# Altium project IMX8SoCIot.PrjPcb (part 3 of 9)

## Sheet IMX8_DISPLAY.SchDoc
size 594 x 420 mm; SheetNumber: 10; SheetTotal: 20
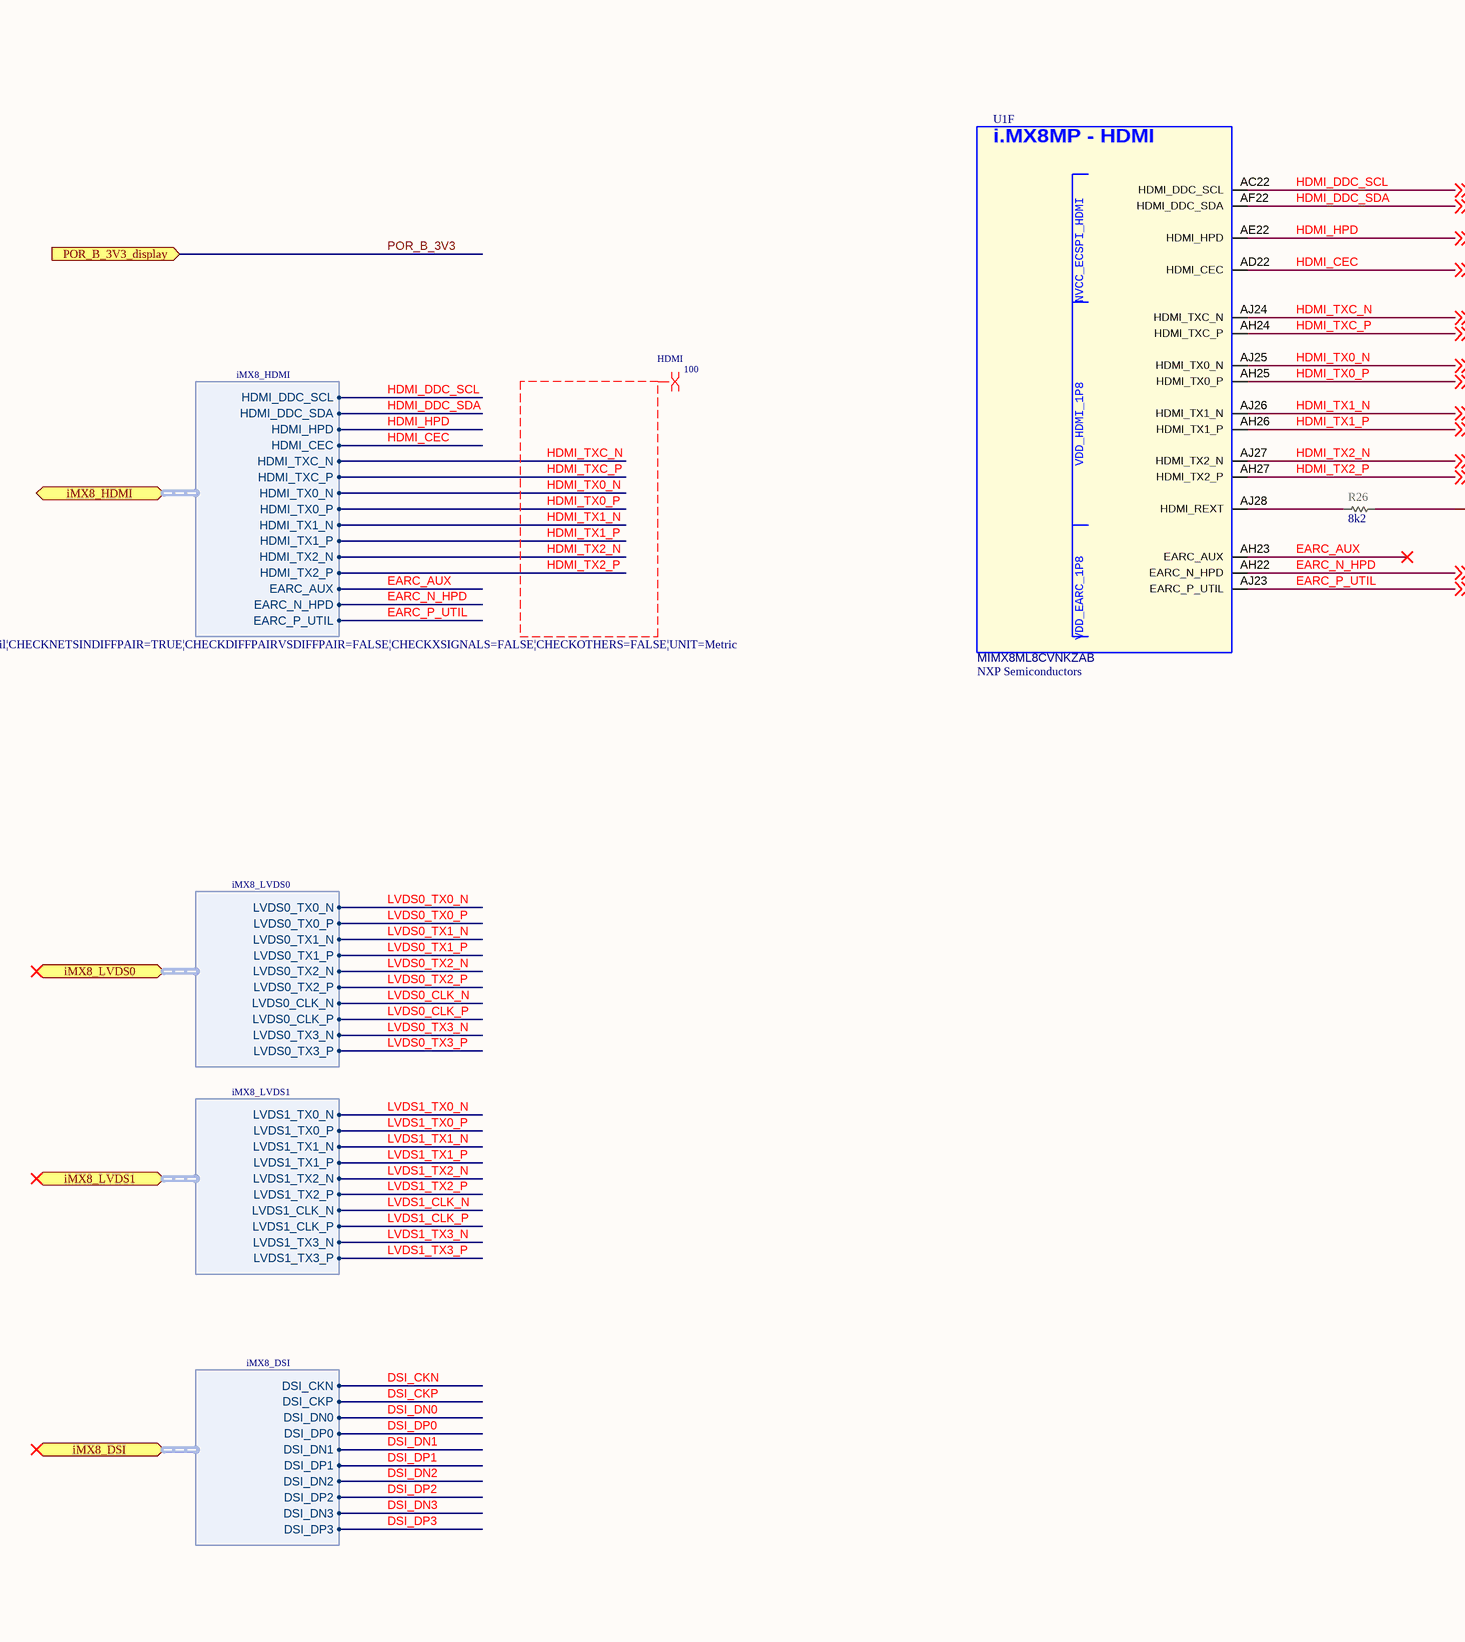
[diagram p8: IMX8_DISPLAY.SchDoc, left]
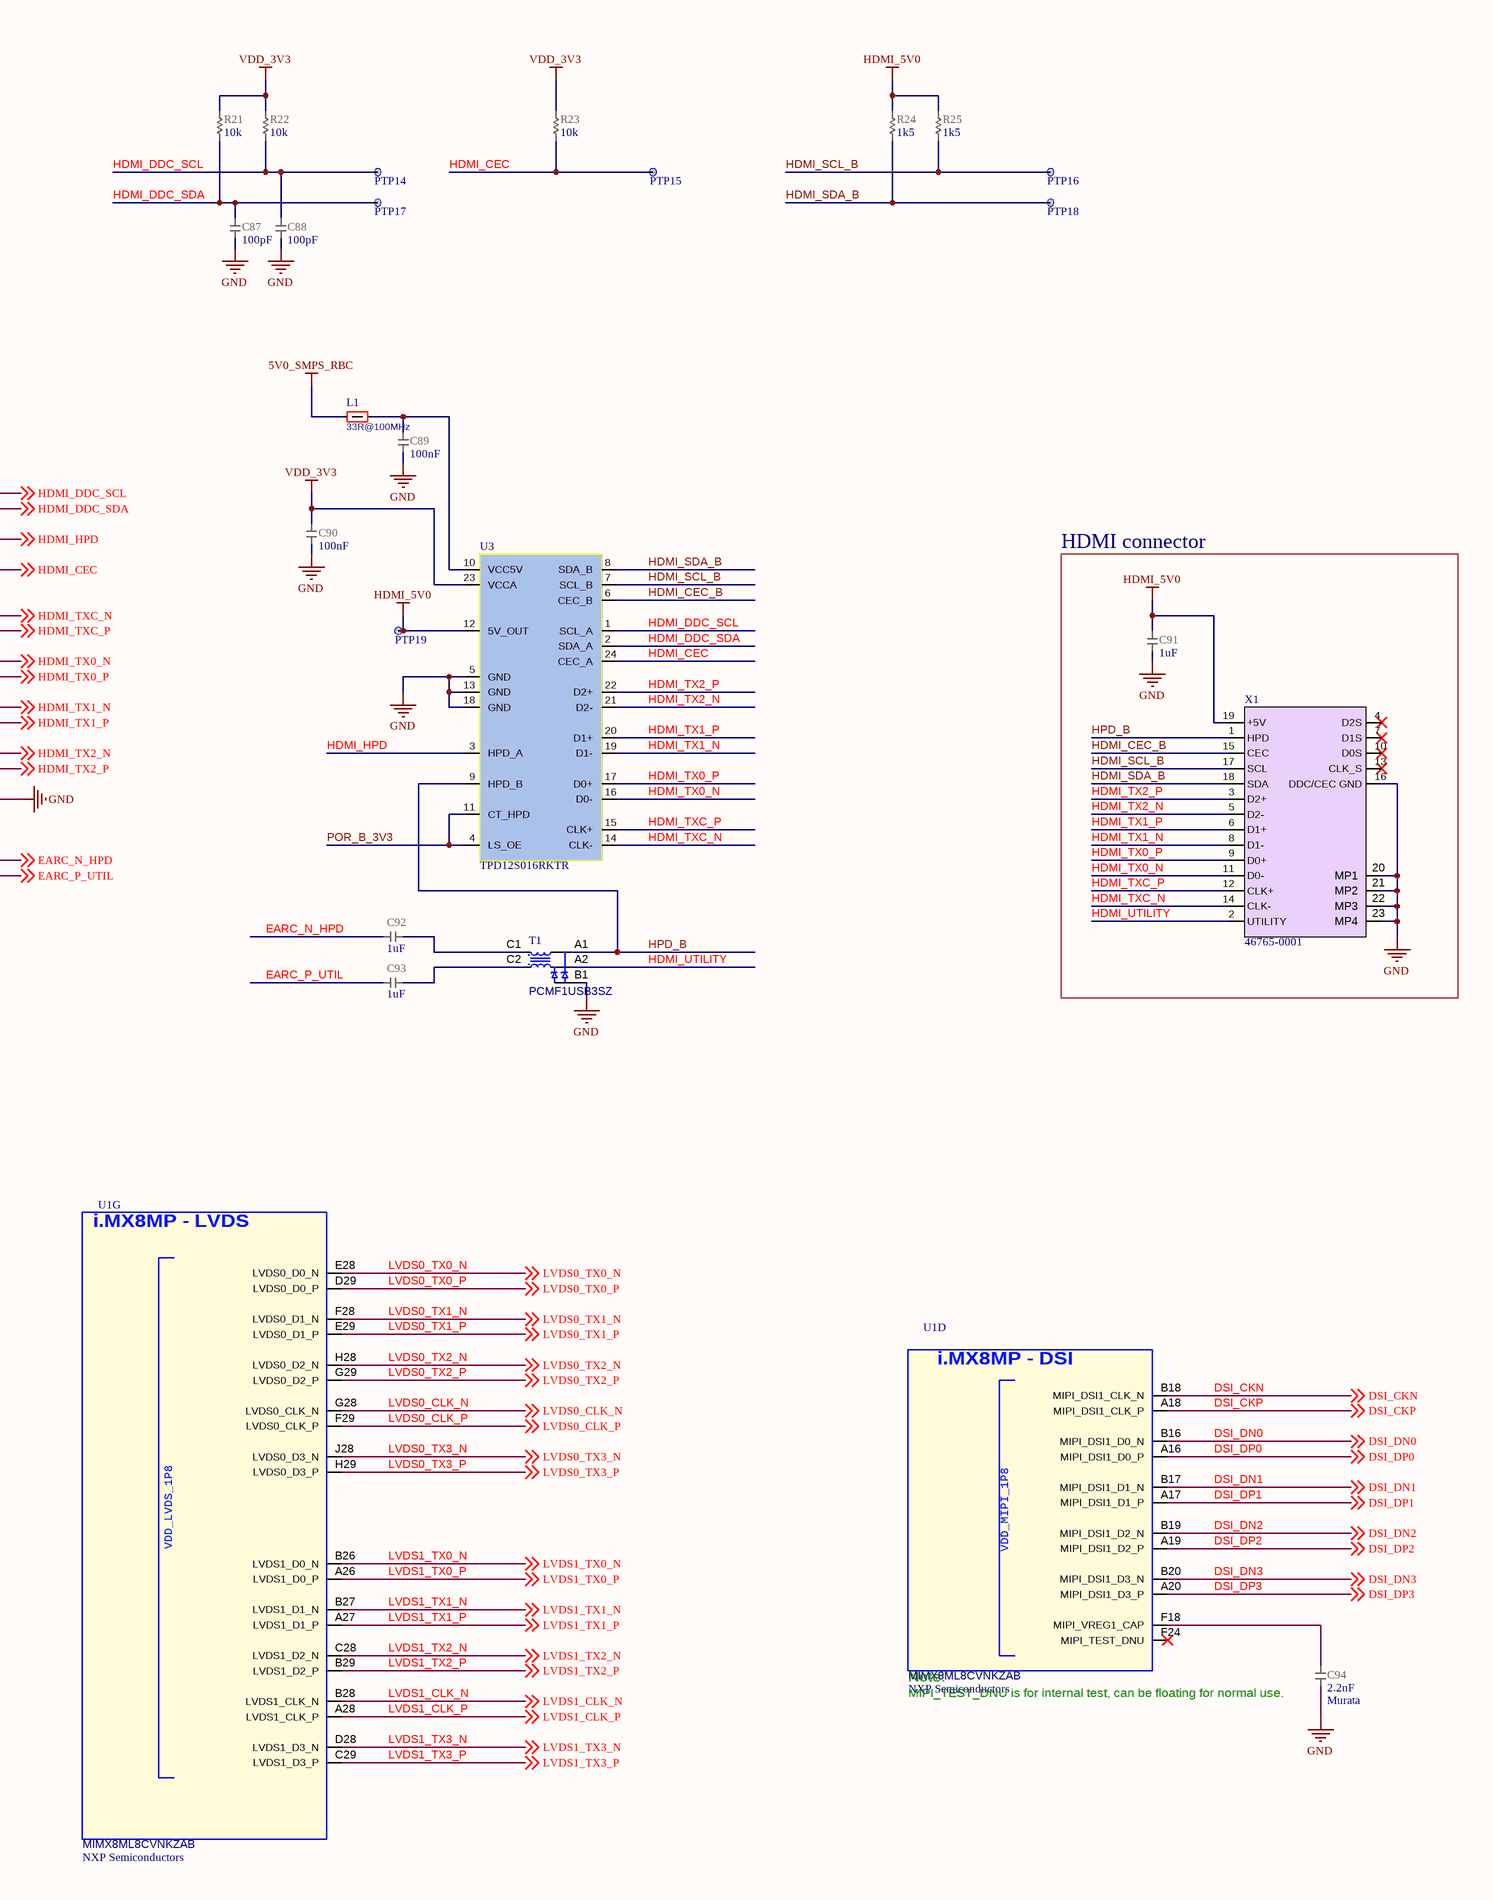
[diagram p9: IMX8_DISPLAY.SchDoc, right]

### Parts
C87  value 100pF  [CAP_0201_UN1Q]  (hidden comment: CAP_0201_100p)
C88  value 100pF  [CAP_0201_UN1Q]  (hidden comment: CAP_0201_100p)
C89  value 100nF  [CAP_0201_UN1Q]  (hidden comment: CAP_0201_100n_X7S_16V)
C90  value 100nF  [CAP_0201_UN1Q]  (hidden comment: CAP_0201_100n_X7S_16V)
C91  value 1uF  [CAP_0201_UN1Q]  (hidden comment: CAP_0201_1uF_X6S)
C92  value 1uF  [CAP_0201_UN1Q]  (hidden comment: CAP_0201_1uF_X6S)
C93  value 1uF  [CAP_0201_UN1Q]  (hidden comment: CAP_0201_1uF_X6S)
C94  value 2.2nF  Manufacturer: Murata  [CAP_0201_UN1Q]  (hidden comment: CAP_0201_2n2)
L1  value 33R@100MHz  [IND_0201_UN1Q]  (hidden comment: FERRITE_0201_BLM03_33Ohm)
PTP14  PTP_0.4mm  [PTP_0.4mm]  (value not drawn)  (no BOM)
PTP15  PTP_0.4mm  [PTP_0.4mm]  (value not drawn)  (no BOM)
PTP16  PTP_0.4mm  [PTP_0.4mm]  (value not drawn)  (no BOM)
PTP17  PTP_0.4mm  [PTP_0.4mm]  (value not drawn)  (no BOM)
PTP18  PTP_0.4mm  [PTP_0.4mm]  (value not drawn)  (no BOM)
PTP19  PTP_0.4mm  [PTP_0.4mm]  (value not drawn)  (no BOM)
R21  value 10k  [RES_0201_UN1Q]  (hidden comment: RES_0201_10k)
R22  value 10k  [RES_0201_UN1Q]  (hidden comment: RES_0201_10k)
R23  value 10k  [RES_0201_UN1Q]  (hidden comment: RES_0201_10k)
R24  value 1k5  [RES_0201_UN1Q]  (hidden comment: RES_0201_1k5)
R25  value 1k5  [RES_0201_UN1Q]  (hidden comment: RES_0201_1k5)
R26  value 8k2  [RES_0201_UN1Q]  (hidden comment: RES_0201_8k2)
T1  Part Number: PCMF1USB3SZ  [PCMF1USB3S_EMI]  (hidden comment: EMI_ESD_PCMF1USB3SZ)
U1  Manufacturer: NXP Semiconductors  [BGA548C50P29X29_1500X1500X148]  (hidden comment: MIMX8ML8CVNKZAB)  (parts D,F,G of 15)
U3  Part Number: TPD12S016RKTR  [UQFN24_RKT0024A_TI]  (hidden comment: TPD12S016RKT)
X1  Part Number: 46765-0001  [uHDMI-SMD-Molex]  (hidden comment: Molex_uHDMI_46765-0001)

### Blocks framed on the sheet
HDMI connector: C91 X1

### Ports
iMX8_DSI (bidir, harness iMX8_DSI), iMX8_HDMI (bidir, harness iMX8_HDMI), iMX8_LVDS0 (bidir, harness iMX8_LVDS0), iMX8_LVDS1 (bidir, harness iMX8_LVDS1), POR_B_3V3_display (in)

### Harnesses
iMX8_LVDS0: LVDS0_TX0_N, LVDS0_TX0_P, LVDS0_TX1_N, LVDS0_TX1_P, LVDS0_TX2_N, LVDS0_TX2_P, LVDS0_CLK_N, LVDS0_CLK_P, LVDS0_TX3_N, LVDS0_TX3_P
iMX8_LVDS1: LVDS1_TX0_N, LVDS1_TX0_P, LVDS1_TX1_N, LVDS1_TX1_P, LVDS1_TX2_N, LVDS1_TX2_P, LVDS1_CLK_N, LVDS1_CLK_P, LVDS1_TX3_N, LVDS1_TX3_P
iMX8_DSI: DSI_CKN, DSI_CKP, DSI_DN0, DSI_DP0, DSI_DN1, DSI_DP1, DSI_DN2, DSI_DP2, DSI_DN3, DSI_DP3
iMX8_HDMI: HDMI_DDC_SCL, HDMI_DDC_SDA, HDMI_HPD, HDMI_CEC, EARC_AUX, EARC_N_HPD, EARC_P_UTIL, HDMI_TXC_N, HDMI_TXC_P, HDMI_TX0_N, HDMI_TX0_P, HDMI_TX1_N, HDMI_TX1_P, HDMI_TX2_N, HDMI_TX2_P

### Nets
5V0_SMPS_RBC: L1.1
GND: C87.1 C88.1 C89.2 C90.2 C91.1 C94.1 R26.2 T1.B1 U3.5(GND) U3.13(GND) U3.18(GND) X1.16(DDC/CEC_GND) X1.20(MP1) X1.21(MP2) X1.22(MP3) X1.23(MP4)
HDMI_5V0: C91.2 PTP19.1(TP) R24.2 R25.2 U3.12(5V_OUT) X1.19(+5V)
VDD_3V3: C90.1 R21.2 R22.2 R23.2 U3.23(VCCA)
DSI_CKN: U1.B18(MIPI_DSI1_CLK_N) ; off-sheet DSI_CKN, port iMX8_DSI.DSI_CKN
DSI_CKP: U1.A18(MIPI_DSI1_CLK_P) ; off-sheet DSI_CKP, port iMX8_DSI.DSI_CKP
DSI_DN0: U1.B16(MIPI_DSI1_D0_N) ; off-sheet DSI_DN0, port iMX8_DSI.DSI_DN0
DSI_DN1: U1.B17(MIPI_DSI1_D1_N) ; off-sheet DSI_DN1, port iMX8_DSI.DSI_DN1
DSI_DN2: U1.B19(MIPI_DSI1_D2_N) ; off-sheet DSI_DN2, port iMX8_DSI.DSI_DN2
DSI_DN3: U1.B20(MIPI_DSI1_D3_N) ; off-sheet DSI_DN3, port iMX8_DSI.DSI_DN3
DSI_DP0: U1.A16(MIPI_DSI1_D0_P) ; off-sheet DSI_DP0, port iMX8_DSI.DSI_DP0
DSI_DP1: U1.A17(MIPI_DSI1_D1_P) ; off-sheet DSI_DP1, port iMX8_DSI.DSI_DP1
DSI_DP2: U1.A19(MIPI_DSI1_D2_P) ; off-sheet DSI_DP2, port iMX8_DSI.DSI_DP2
DSI_DP3: U1.A20(MIPI_DSI1_D3_P) ; off-sheet DSI_DP3, port iMX8_DSI.DSI_DP3
EARC_AUX: U1.AH23(EARC_AUX) ; port iMX8_HDMI.EARC_AUX
EARC_N_HPD: C92.1 U1.AH22(EARC_N_HPD) ; off-sheet EARC_N_HPD, port iMX8_HDMI.EARC_N_HPD
EARC_P_UTIL: C93.1 U1.AJ23(EARC_P_UTIL) ; off-sheet EARC_P_UTIL, port iMX8_HDMI.EARC_P_UTIL
HDMI_CEC: PTP15.1(TP) R23.1 U1.AD22(HDMI_CEC) U3.24(CEC_A) ; off-sheet HDMI_CEC, port iMX8_HDMI.HDMI_CEC
HDMI_CEC_B: U3.6(CEC_B) X1.15(CEC)
HDMI_DDC_SCL: C88.2 PTP14.1(TP) R22.1 U1.AC22(HDMI_DDC_SCL) U3.1(SCL_A) ; off-sheet HDMI_DDC_SCL, port iMX8_HDMI.HDMI_DDC_SCL
HDMI_DDC_SDA: C87.2 PTP17.1(TP) R21.1 U1.AF22(HDMI_DDC_SDA) U3.2(SDA_A) ; off-sheet HDMI_DDC_SDA, port iMX8_HDMI.HDMI_DDC_SDA
HDMI_HPD: U1.AE22(HDMI_HPD) U3.3(HPD_A) ; off-sheet HDMI_HPD, port iMX8_HDMI.HDMI_HPD
HDMI_SCL_B: PTP16.1(TP) R25.1 U3.7(SCL_B) X1.17(SCL)
HDMI_SDA_B: PTP18.1(TP) R24.1 U3.8(SDA_B) X1.18(SDA)
HDMI_TX0_N: U1.AJ25(HDMI_TX0_N) U3.16(D0-) X1.11(D0-) ; off-sheet HDMI_TX0_N, port iMX8_HDMI.HDMI_TX0_N
HDMI_TX0_P: U1.AH25(HDMI_TX0_P) U3.17(D0+) X1.9(D0+) ; off-sheet HDMI_TX0_P, port iMX8_HDMI.HDMI_TX0_P
HDMI_TX1_N: U1.AJ26(HDMI_TX1_N) U3.19(D1-) X1.8(D1-) ; off-sheet HDMI_TX1_N, port iMX8_HDMI.HDMI_TX1_N
HDMI_TX1_P: U1.AH26(HDMI_TX1_P) U3.20(D1+) X1.6(D1+) ; off-sheet HDMI_TX1_P, port iMX8_HDMI.HDMI_TX1_P
HDMI_TX2_N: U1.AJ27(HDMI_TX2_N) U3.21(D2-) X1.5(D2-) ; off-sheet HDMI_TX2_N, port iMX8_HDMI.HDMI_TX2_N
HDMI_TX2_P: U1.AH27(HDMI_TX2_P) U3.22(D2+) X1.3(D2+) ; off-sheet HDMI_TX2_P, port iMX8_HDMI.HDMI_TX2_P
HDMI_TXC_N: U1.AJ24(HDMI_TXC_N) U3.14(CLK-) X1.14(CLK-) ; off-sheet HDMI_TXC_N, port iMX8_HDMI.HDMI_TXC_N
HDMI_TXC_P: U1.AH24(HDMI_TXC_P) U3.15(CLK+) X1.12(CLK+) ; off-sheet HDMI_TXC_P, port iMX8_HDMI.HDMI_TXC_P
HDMI_UTILITY: T1.A2 X1.2(UTILITY)
HPD_B: T1.A1 U3.9(HPD_B) X1.1(HPD)
LVDS0_CLK_N: U1.G28(LVDS0_CLK_N) ; off-sheet LVDS0_CLK_N, port iMX8_LVDS0.LVDS0_CLK_N
LVDS0_CLK_P: U1.F29(LVDS0_CLK_P) ; off-sheet LVDS0_CLK_P, port iMX8_LVDS0.LVDS0_CLK_P
LVDS0_TX0_N: U1.E28(LVDS0_D0_N) ; off-sheet LVDS0_TX0_N, port iMX8_LVDS0.LVDS0_TX0_N
LVDS0_TX0_P: U1.D29(LVDS0_D0_P) ; off-sheet LVDS0_TX0_P, port iMX8_LVDS0.LVDS0_TX0_P
LVDS0_TX1_N: U1.F28(LVDS0_D1_N) ; off-sheet LVDS0_TX1_N, port iMX8_LVDS0.LVDS0_TX1_N
LVDS0_TX1_P: U1.E29(LVDS0_D1_P) ; off-sheet LVDS0_TX1_P, port iMX8_LVDS0.LVDS0_TX1_P
LVDS0_TX2_N: U1.H28(LVDS0_D2_N) ; off-sheet LVDS0_TX2_N, port iMX8_LVDS0.LVDS0_TX2_N
LVDS0_TX2_P: U1.G29(LVDS0_D2_P) ; off-sheet LVDS0_TX2_P, port iMX8_LVDS0.LVDS0_TX2_P
LVDS0_TX3_N: U1.J28(LVDS0_D3_N) ; off-sheet LVDS0_TX3_N, port iMX8_LVDS0.LVDS0_TX3_N
LVDS0_TX3_P: U1.H29(LVDS0_D3_P) ; off-sheet LVDS0_TX3_P, port iMX8_LVDS0.LVDS0_TX3_P
LVDS1_CLK_N: U1.B28(LVDS1_CLK_N) ; off-sheet LVDS1_CLK_N, port iMX8_LVDS1.LVDS1_CLK_N
LVDS1_CLK_P: U1.A28(LVDS1_CLK_P) ; off-sheet LVDS1_CLK_P, port iMX8_LVDS1.LVDS1_CLK_P
LVDS1_TX0_N: U1.B26(LVDS1_D0_N) ; off-sheet LVDS1_TX0_N, port iMX8_LVDS1.LVDS1_TX0_N
LVDS1_TX0_P: U1.A26(LVDS1_D0_P) ; off-sheet LVDS1_TX0_P, port iMX8_LVDS1.LVDS1_TX0_P
LVDS1_TX1_N: U1.B27(LVDS1_D1_N) ; off-sheet LVDS1_TX1_N, port iMX8_LVDS1.LVDS1_TX1_N
LVDS1_TX1_P: U1.A27(LVDS1_D1_P) ; off-sheet LVDS1_TX1_P, port iMX8_LVDS1.LVDS1_TX1_P
LVDS1_TX2_N: U1.C28(LVDS1_D2_N) ; off-sheet LVDS1_TX2_N, port iMX8_LVDS1.LVDS1_TX2_N
LVDS1_TX2_P: U1.B29(LVDS1_D2_P) ; off-sheet LVDS1_TX2_P, port iMX8_LVDS1.LVDS1_TX2_P
LVDS1_TX3_N: U1.D28(LVDS1_D3_N) ; off-sheet LVDS1_TX3_N, port iMX8_LVDS1.LVDS1_TX3_N
LVDS1_TX3_P: U1.C29(LVDS1_D3_P) ; off-sheet LVDS1_TX3_P, port iMX8_LVDS1.LVDS1_TX3_P
POR_B_3V3: U3.4(LS_OE) U3.11(CT_HPD) ; port POR_B_3V3_display
NetC89_1: C89.1 L1.2 U3.10(VCC5V)
NetC92_2: C92.2 T1.C1
NetC93_2: C93.2 T1.C2
NetC94_2: C94.2 U1.F18(MIPI_VREG1_CAP)
NetR26_1: R26.1 U1.AJ28(HDMI_REXT)

Not connected (* = marked no-connect by the designer): U1 F24(MIPI_TEST_DNU)*; X1 4(D2S)* 7(D1S)* 10(D0S)* 13(CLK_S)*

### Layout directives
differential pair; net class HDMI; rule Matched Net Lengths [Tolerance = 0.1mm]; differential pair class 100: HDMI_TX0_N, HDMI_TX0_P, HDMI_TX1_N, HDMI_TX1_P, HDMI_TX2_N, HDMI_TX2_P, HDMI_TXC_N, HDMI_TXC_P

### Notes on the sheet
- (near C94) MIPI_TEST_DNU is for internal test, can be floating for normal use.
- Note:
- DWG NO:
- REV:
- THIS DOCUMENT AND THE DATA DISCLOSED HEREIN OR
- HEREWITH IS THE PROPERTY OF ALTIUM LIMITED AND MAY
- BE FREELY DISTRIBUTED IN WHOLE. NO RIGHTS ARE
- RESERVED OR EXPRESS OR IMPLIED WARANTEE GIVEN.
- REVISION
- DESCRIPTION
- DATE
- APPROVED
- ENG:
- APPROVALS
- PROJECT
- DSN:
- CHK:
- REFERENCE DOCUMENTS
- PROJECT REVISION:
- TITLE
- DOCUMENT REVISION:
- DESIGN ITEM:
- BOM:
- FAB DWG:
- PCB DWG:
- ASSY DWG:
- SCALE:
- A2
- SIZE
- CAGE CODE
- FILE NAME
- DWG NO.
- SHEET
- OF
- REV
- (in symbol CMP-001-000983-8, part D) i.MX8MP - DSI
- (in symbol CMP-001-000983-8, part F) i.MX8MP - HDMI
- (in symbol CMP-001-000983-8, part G) i.MX8MP - LVDS

### Library data of the parts
C87 C88 = CMP-001-000310-14: CAP; Part Number: CC0201KRX7R8BB101; Manufacturer: YAGEO; Temperature characteristics: X7R; Voltage: 25V; Tolerance: +/-10%; Sort order: 302; HasBeenBuilt: TBD; Alternative component: Allowed; System: RLC; Package: 0201; ClassName: SMALL; ComponentLink1Description: 1_Datasheet; ComponentLink2Description: 2_Product page; ComponentLink3Description: 3_X-information; ComponentLink4Description: 4_X-information; Creation date: 20190101
C89 C90 = CMP-001-000385-16: CAP; Part Number: GRM033C71C104KE14D; Manufacturer: Murata; Temperature characteristics: X7S; Tolerance: +/-10%; Sort order: 302; HasBeenBuilt: TBD; Alternative component: Allowed; Voltage: 16V; System: RLC; Package: 0201; ClassName: SMALL; ComponentLink1Description: 1_Datasheet; ComponentLink2Description: 2_Product page; ComponentLink3Description: 3_X-information; ComponentLink4Description: 4_X-information; Creation date: 20190101; Source: RLC_UN1Q.SchLib; Manufacturer Part Number: GRM033C71C104KE14D; Component Type: Capacitor
C91-C93 = CMP-001-000336-15: CAP; Part Number: KGM03CS61A105MH; Manufacturer: Kyocera; Manufacturer: KYOCERA AVX; Temperature characteristics: X6S; Voltage: 10V; Tolerance: +/-20%; Sort order: 302; HasBeenBuilt: False; Alternative component: Allowed; System: RLC; Package: 0201; Operating temperature range: -55C to +105C; ClassName: SMALL; ComponentLink1Description: 1_Datasheet; ComponentLink2Description: 2_Product page; ComponentLink3Description: 3_X-information; ComponentLink4Description: 4_X-information; Creation date: 20190101; Source: RLC_UN1Q.SchLib; Manufacturer Part Number: KGM03CS61A105MH; Component Type: Capacitor
C94 = CMP-001-000281-14: CAP; Part Number: GRM033R71E222KA12J; Temperature characteristics: X7R; Tolerance: +/-10%; Sort order: 302; HasBeenBuilt: TBD; Alternative component: Allowed; Voltage: 25V; System: RLC; Package: 0201; ComponentLink1Description: 1_Datasheet; ComponentLink2Description: 2_Product page; ComponentLink3Description: 3_X-information; ComponentLink4Description: 4_X-information; Creation date: 20222504; ClassName: SMALL; Source: RLC_UN1Q.SchLib; Manufacturer Part Number: GRM033R71E222KA12J; Component Type: Capacitor
L1 = CMP-001-000744-7: FERRITE; Manufacturer: Murata; Part Number: BLM03PG330SN1; Tolerance: 25%; Sort order: 362; HasBeenBuilt: TBD; System: Discrete; Package: 0201; Operating temperature range: -55 ... +125C; ClassName: SMALL; ComponentLink1Description: 1_Datasheet; ComponentLink1URL: https://www.murata.com/en-us/products/productdetail.aspx?cate=luNoiseSupprFilteChipFerriBead&partno=BLM03PG330SN1%23; ComponentLink2Description: 2_Product page; ComponentLink3Description: 3_X-information; ComponentLink4Description: 4_X-information; Creation date: 20200304; Source: Discrete_UN1Q.SchLib; Manufacturer Part Number: BLM03PG330SN1; Component Type: Ferrite
PTP14-PTP19 = CMP-001-001296-3: Production Testpoint 0.4mm. Flying probe. Use 1mm pitch.; Part Number: PTP 0.4mm; ComponentLink4Description: 4_X-information; ComponentLink1Description: 1_Datasheet; Sort order: -; ClassName: SMALL; System: Test Point; HasBeenBuilt: -; Design Item ID: PTP_0.4mm; ComponentLink3Description: 3_X-information; Creation date: 20240909; ComponentLink2Description: 2_Product page; Component Type: Test Point
R21-R23 = CMP-001-000446-13: RES; Part Number: RC0201FR-0710KL; Manufacturer: YAGEO; Power Rating: 1/20W; Sort order: 322; HasBeenBuilt: TBD; Tolerance: 1%; Alternative component: Allowed; System: RLC; Package: 0201; ClassName: SMALL; ComponentLink1Description: 1_Datasheet; ComponentLink2Description: 2_Product page; ComponentLink3Description: 3_X-information; ComponentLink4Description: 4_X-information; Creation date: 20190101; Source: RLC_UN1Q.SchLib; Component Type: Resistor
R24 R25 = CMP-001-000455-11: RES; Part Number: RC0201FR-071K5L; Manufacturer: YAGEO; Power Rating: 1/20W; Sort order: 322; HasBeenBuilt: False; Tolerance: 1%; Alternative component: Allowed; System: RLC; Package: 0201; ClassName: SMALL; ComponentLink1Description: 1_Datasheet; ComponentLink2Description: 2_Product page; ComponentLink3Description: 3_X-information; ComponentLink4Description: 4_X-information; Creation date: 20190101; Source: RLC_UN1Q.SchLib; Component Type: Resistor
R26 = CMP-001-001255-9: RES; Part Number: ERJ1GNF8201C; Manufacturer: Panasonic Electronic Components; Tolerance: 1%; Power Rating: 1/20W; Sort order: 322; Alternative component: Allowed; System: RLC; Package: 0201; ClassName: SMALL; ComponentLink1Description: 1_Datasheet; ComponentLink2Description: 2_Product page; ComponentLink3Description: 3_X-information; ComponentLink4Description: 4_X-information; Creation date: 20240404; Component Type: Resistor
T1 = CMP-001-000967-4: EMI Filter with ESD 15kV differential pair; Manufacturer: Nexperia; Sort order: 441; System: Discrete; ComponentLink1Description: 1_Datasheet; ComponentLink1URL: https://assets.nexperia.com/documents/data-sheet/PCMFXUSB3S_SER.pdf; ComponentLink2Description: 2_Product page; ComponentLink2URL: https://www.nexperia.com/search?searchCategory=&q=PCMF1USB3SZ; ComponentLink3Description: 3_X-information; ComponentLink4Description: 4_X-information; Creation date: 15042024; Dimensions WxLxH: 1.17 x 0.77 x 0.60mm; Operating temperature range: -40 ... +125 °C; Package: WLCSP5; Source: UUDET_KOMPONENTIT.SchLib; Manufacturer Part Number: PCMF1USB3SZ; Component Type: ESD & EMI
U1 = CMP-001-000983-8: CPU QUAD CORTEX A53+M4 1.6GHZ BGA548 Industrial; Sort order: 501; System: IC; ComponentLink1Description: 1_Datasheet; ComponentLink1URL: https://www.nxp.com/part/MIMX8ML8CVNKZAB#/; ComponentLink2Description: 2_Product page; ComponentLink3Description: 3_X-information; ComponentLink4Description: 4_X-information; Creation date: 20240524; Dimensions WxLxH: 15 x 15 x 1.33mm; Manufacturer: NXP SEMICONDUCTORS; Operating temperature range: -40... +105 °C; Package: FCBGA548; Part Number: MIMX8ML8CVNKZAB; ClassName: BIG; Source: UUDET_KOMPONENTIT.SchLib; Design Item ID: MIMX8ML8CVNKZAB; Manufacturer Part Number: MIMX8ML8CVNKZAB; Component Type: Processor
U3 = CMP-031-000038-2: HDMI ESD Protection and I2C Level Shifting Buffer; Manufacturer: Texas Instruments; System: IC; HasBeenBuilt: Saluki3_HW_RIB_2; Sort order: 405; ComponentLink1Description: 1_Datasheet; Dimensions WxLxH: 2.1x4.1x0.55; Source: UUDET_KOMPONENTIT.SchLib; Design Item ID: TPD12S016RKT; ComponentLink1URL: https://www.ti.com/lit/ds/symlink/tpd12s016.pdf; Package: UQFN24; ComponentLink4Description: 4_X-information; ComponentLink3Description: 3_X-information; ComponentLink2URL: https://www.ti.com/product/TPD12S016; ComponentLink2Description: 2_Product page; RoHS: RoHS3; Operating temperature range: -40... +85 °C; Creation Date: 20230510; ECCN: EAR99; Manufacturer Part Number: TPD12S016RKTR; Component Type: ESD & EMI
X1 = CMP-001-000218-15: Micro-HDMI connector, surface mount; Manufacturer: Molex; Sort order: 111; RoHS: RoHS 3; Design Item ID: Molex_uHDMI_46765-0001; ComponentLink1Description: 1_Datasheet; Source: Conn_UN1Q.SchLib; Dimensions WxLxH: 6.5x7.7x2.9; System: Connector; ClassName: BIG; ComponentLink3Description: 3_X-information; ECCN: EAR99; ComponentLink1URL: https://www.molex.com/molex/products/part-detail/io_connectors/0467650001; ComponentLink4Description: 4_X-information; Creation date: 20191231; ComponentLink2Description: 2_Product page; Manufacturer Part Number: 46765-0001; Component Type: Interface Connector

## Sheet IMX8_eMMC.SchDoc
size 594 x 420 mm; SheetNumber: 12; SheetTotal: 20
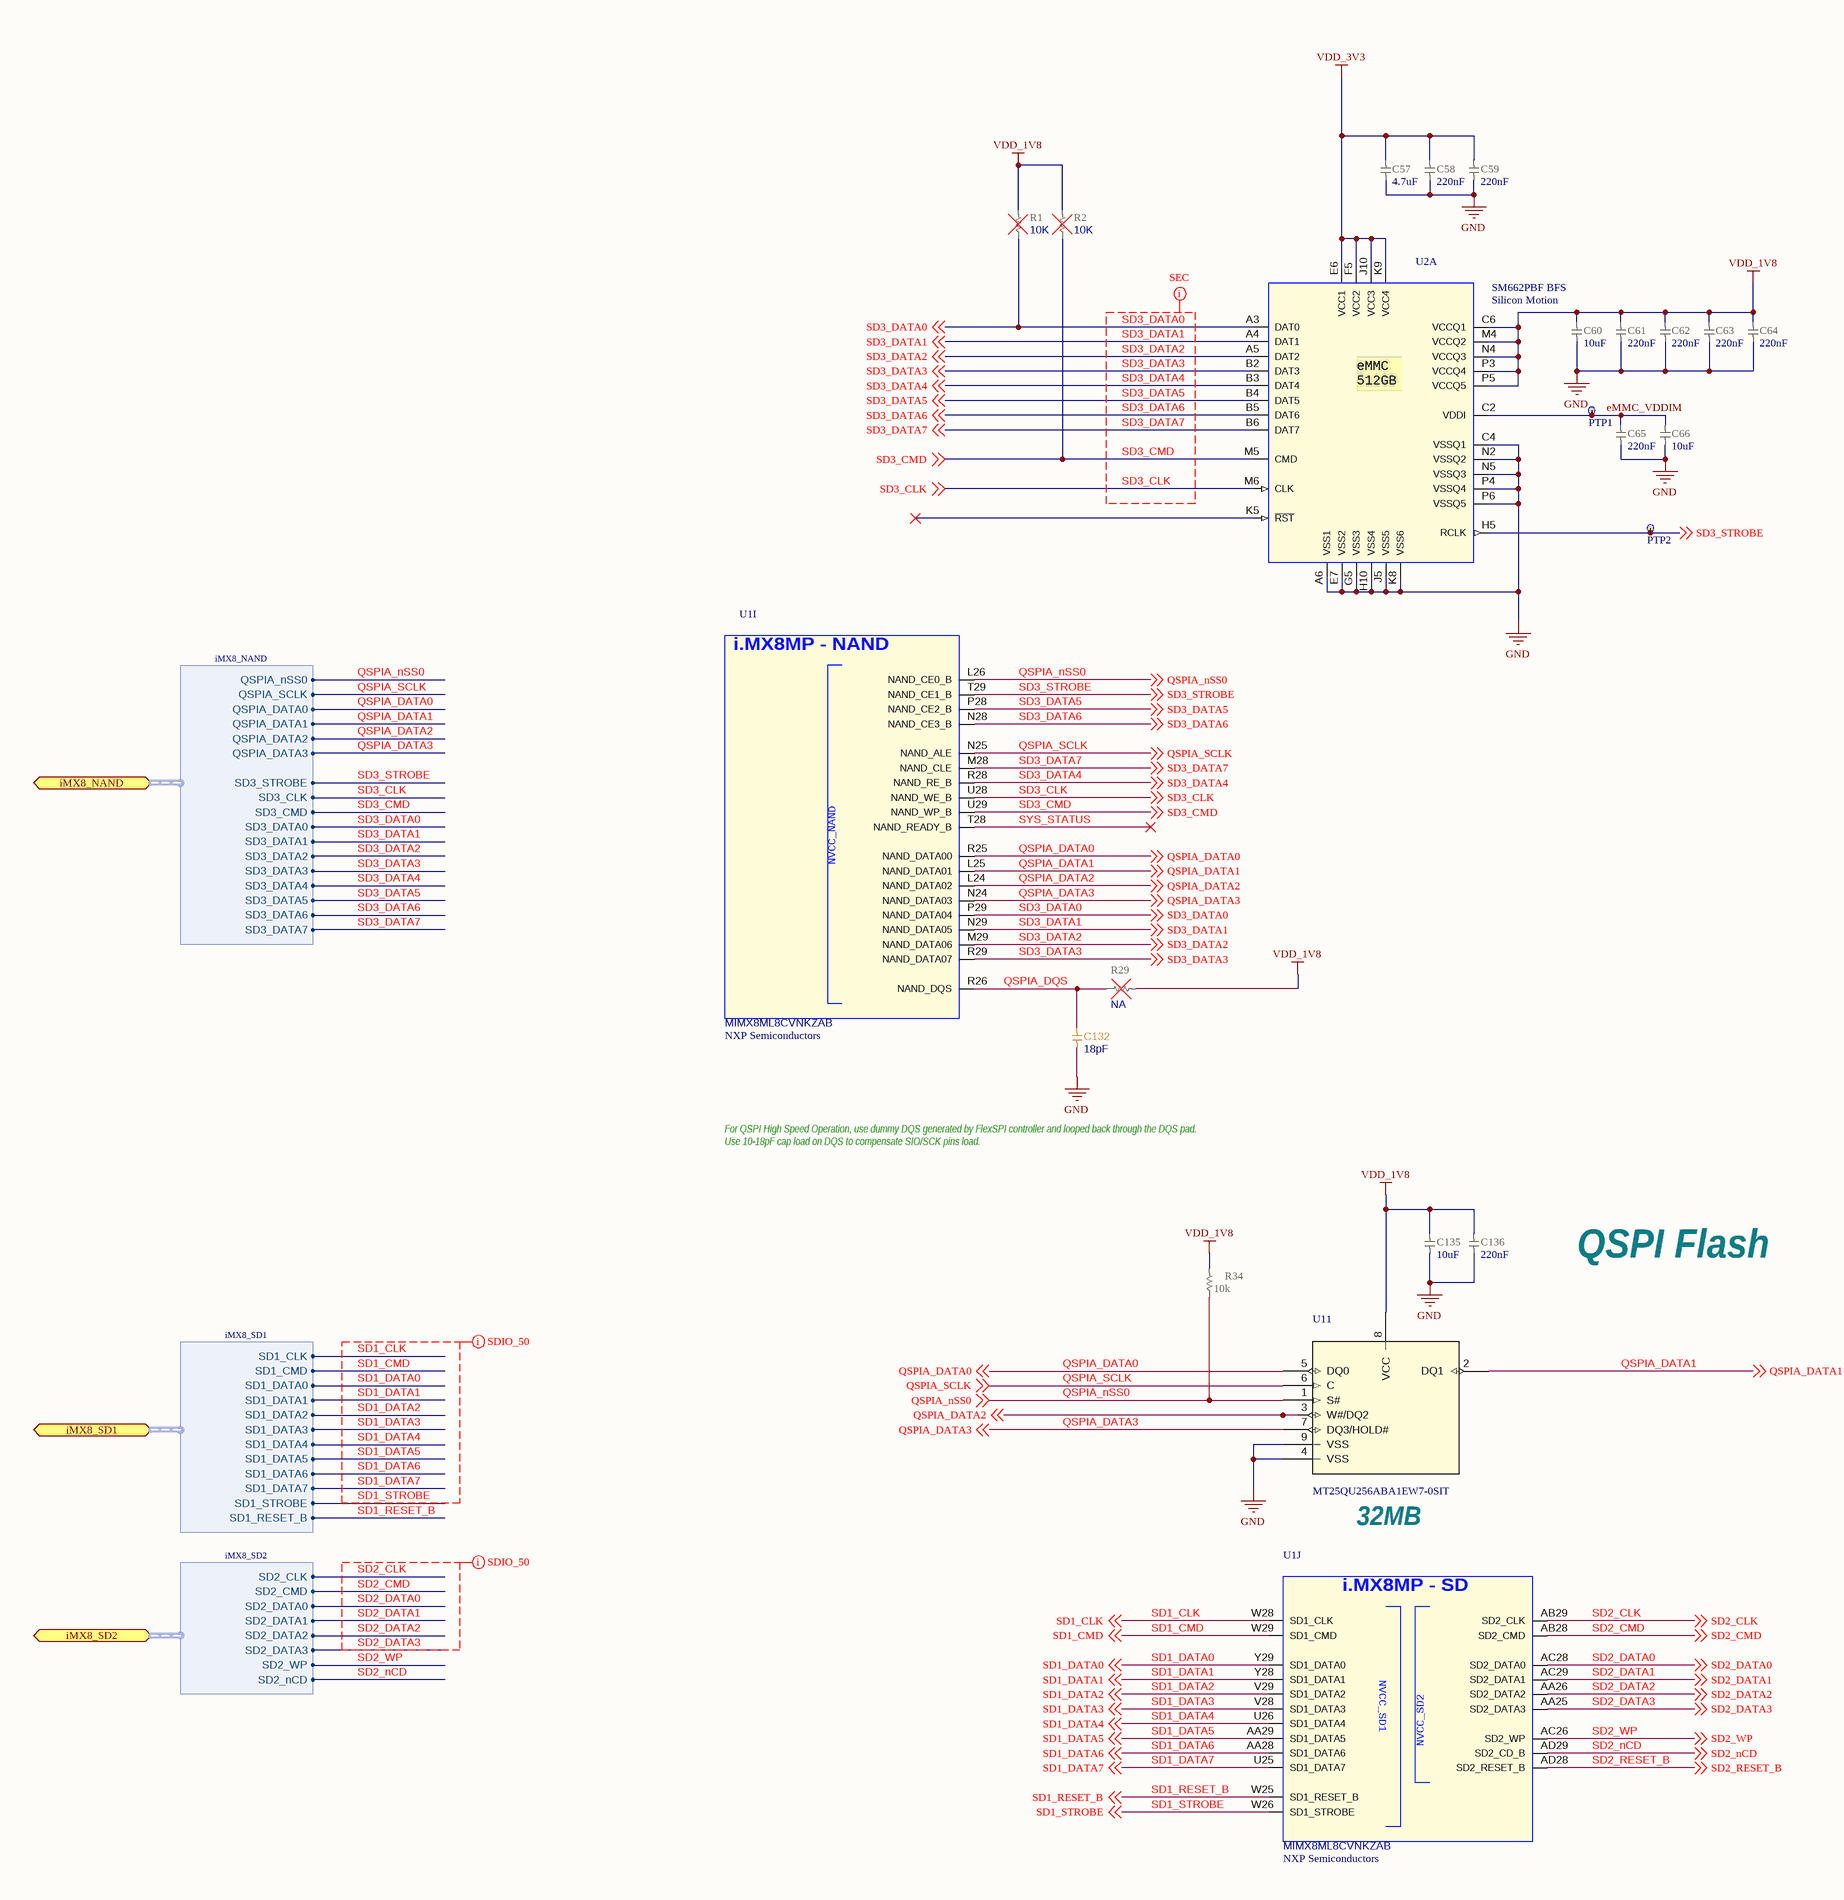
[diagram p10: IMX8_eMMC.SchDoc, left]
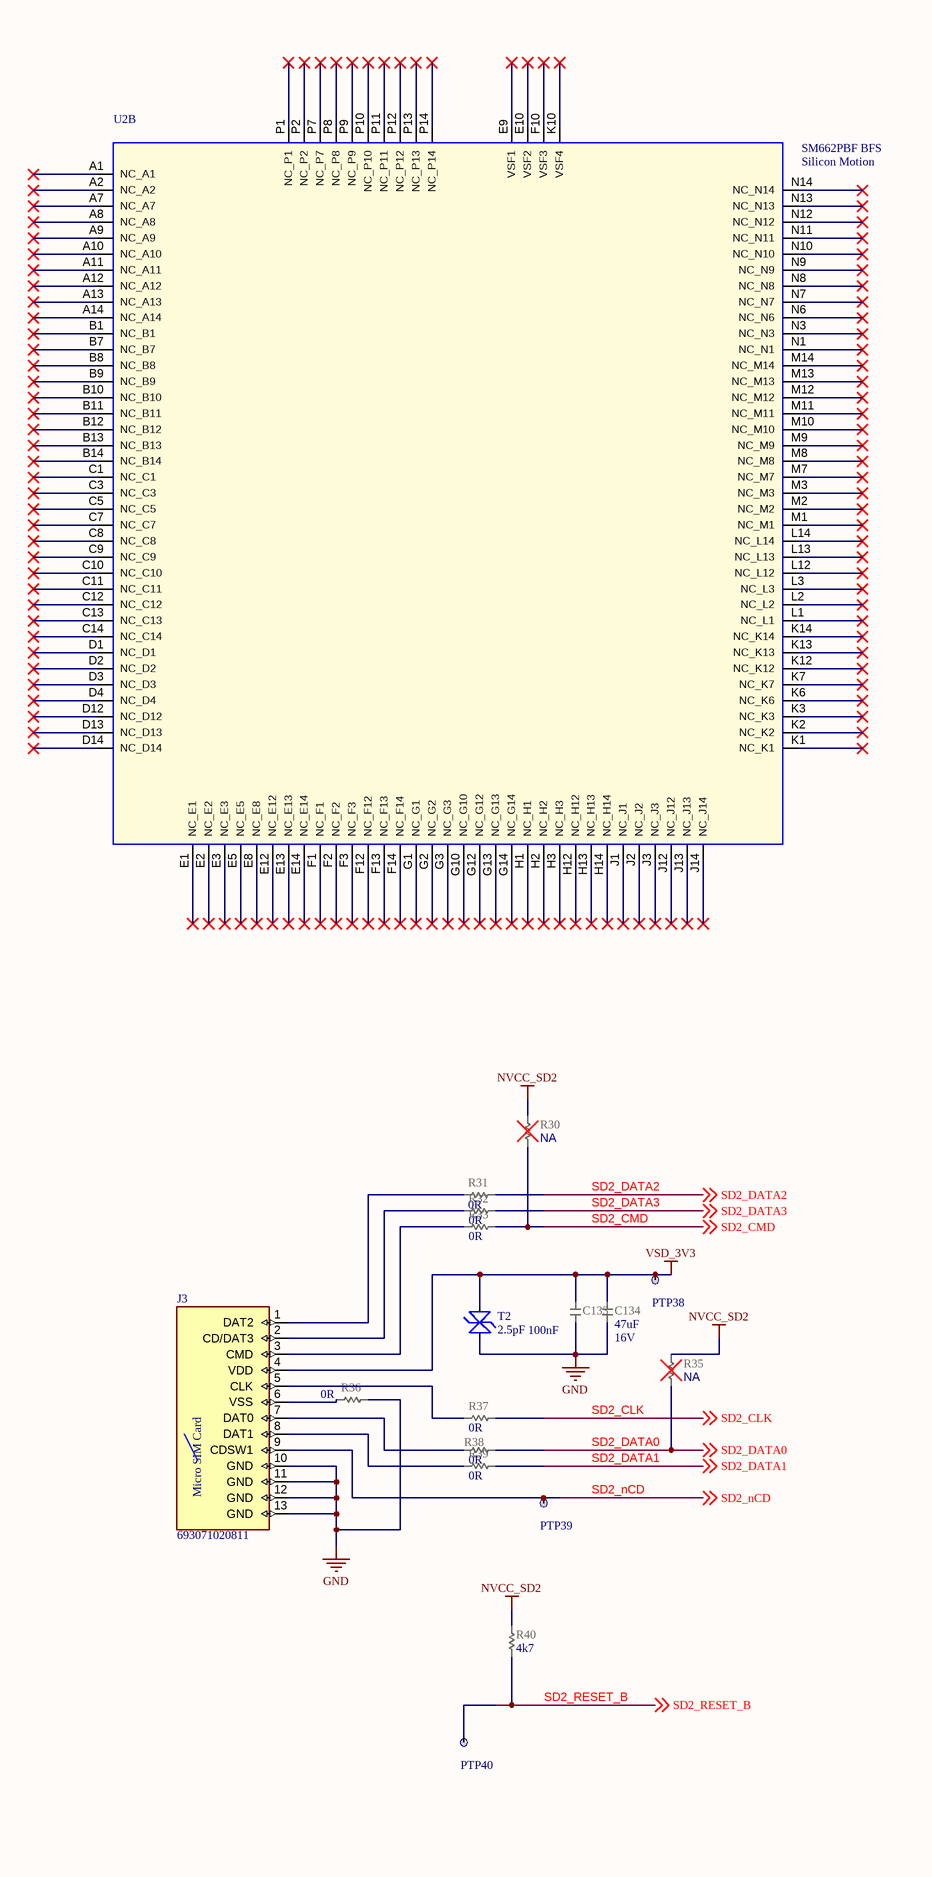
[diagram p11: IMX8_eMMC.SchDoc, right]

### Parts
(Parts that share a designator on the sheet are numbered #1, #2 ... from top to bottom, then left to right.)
C57  value 4.7uF  [CAP_0402_H09W07_UN1Q]  (hidden comment: CAP_0402_4u7_10V_X6S)
C58  value 220nF  [CAP_0201_UN1Q]  (hidden comment: CAP_0201_220n_10V_X6S)
C59  value 220nF  [CAP_0201_UN1Q]  (hidden comment: CAP_0201_220n_10V_X6S)
C60  value 10uF  [CAP_0402_H09W07_UN1Q]  (hidden comment: CAP_0402_10u_X6S)
C61  value 220nF  [CAP_0201_UN1Q]  (hidden comment: CAP_0201_220n_10V_X6S)
C62  value 220nF  [CAP_0201_UN1Q]  (hidden comment: CAP_0201_220n_10V_X6S)
C63  value 220nF  [CAP_0201_UN1Q]  (hidden comment: CAP_0201_220n_10V_X6S)
C64  value 220nF  [CAP_0201_UN1Q]  (hidden comment: CAP_0201_220n_10V_X6S)
C65  value 220nF  [CAP_0201_UN1Q]  (hidden comment: CAP_0201_220n_10V_X6S)
C66  value 10uF  [CAP_0402_H09W07_UN1Q]  (hidden comment: CAP_0402_10u_X6S)
C132#1  value 18pF  [CAP_0201_UN1Q]  (hidden comment: CAP_0201_18p_RF_MATCHING)
C133#1  value 100nF  [CAP_0201_UN1Q]  (hidden comment: CAP_0201_100n_X7S_16V)
C134#1  value 47uF  Voltage: 16V  [CAP_1210_UN1Q_1]  (hidden comment: CAP_1210_47uF_16V_X6S)
C135#1  value 10uF  [CAP_0402_H09W07_UN1Q]  (hidden comment: CAP_0402_10u_X6S)
C136#1  value 220nF  [CAP_0201_UN1Q]  (hidden comment: CAP_0201_220n_10V_X6S)
J3#1  693071020811  [693071020811]
PTP1#1  PTP_0.4mm  [PTP_0.4mm]  (value not drawn)  (no BOM)
PTP2#1  PTP_0.4mm  [PTP_0.4mm]  (value not drawn)  (no BOM)
PTP38#1  PTP_0.4mm  [PTP_0.4mm]  (value not drawn)  (no BOM)
PTP39#1  PTP_0.4mm  [PTP_0.4mm]  (value not drawn)  (no BOM)
PTP40#1  PTP_0.4mm  [PTP_0.4mm]  (value not drawn)  (no BOM)
R1#1  value 10K  [RES_0201_UN1Q]  (hidden comment: RES_0201_NA)
R2#1  value 10K  [RES_0201_UN1Q]  (hidden comment: RES_0201_NA)
R29  value NA  [RES_0201_UN1Q]  (hidden comment: RES_0201_NA)
R30  value NA  [RES_0201_UN1Q]  (hidden comment: RES_0201_NA)
R31  value 0R  [RES_0201_UN1Q]  (hidden comment: RES_0201_0R)
R32  value 0R  [RES_0201_UN1Q]  (hidden comment: RES_0201_0R)
R33  value 0R  [RES_0201_UN1Q]  (hidden comment: RES_0201_0R)
R34  10k  [RES_0201_UN1Q]
R35  value NA  [RES_0201_UN1Q]  (hidden comment: RES_0201_NA)
R36  value 0R  [RES_0201_UN1Q]  (hidden comment: RES_0201_0R)
R37  value 0R  [RES_0201_UN1Q]  (hidden comment: RES_0201_0R)
R38  value 0R  [RES_0201_UN1Q]  (hidden comment: RES_0201_0R)
R39  value 0R  [RES_0201_UN1Q]  (hidden comment: RES_0201_0R)
R40  value 4k7  [RES_0201_UN1Q]  (hidden comment: RES_0201_4k7)
T2  value 2.5pF  [TVS_0201_EZAEG]  (hidden comment: TVS_0201_2.5pF_5V)
U1  Manufacturer: NXP Semiconductors  [BGA548C50P29X29_1500X1500X148]  (hidden comment: MIMX8ML8CVNKZAB)  (parts I,J of 15)
U2  Manufacturer: Silicon Motion  [GA153C50P14X14_1150X1300X120]  (hidden comment: SM662PBF BFS)  (parts A,B of 2)
U11#1  MT25QU256ABA1EW7-0SIT  [W-PDFN-8MLP8_W7_MRN]

### Ports
iMX8_NAND (bidir, harness iMX8_NAND), iMX8_SD1 (bidir, harness iMX8_SD1), iMX8_SD2 (bidir, harness iMX8_SD2)

### Harnesses
iMX8_SD1: SD1_CLK, SD1_CMD, SD1_DATA0, SD1_DATA1, SD1_DATA2, SD1_DATA3, SD1_DATA4, SD1_DATA5, SD1_DATA6, SD1_DATA7, SD1_RESET_B, SD1_STROBE
iMX8_SD2: SD2_CLK, SD2_CMD, SD2_DATA0, SD2_DATA1, SD2_DATA2, SD2_DATA3, SD2_WP, SD2_nCD
iMX8_NAND: QSPIA_SCLK, QSPIA_DATA0, QSPIA_nSS0, QSPIA_DATA1, QSPIA_DATA2, QSPIA_DATA3, SD3_STROBE, SD3_CLK, SD3_CMD, SD3_DATA0, SD3_DATA1, SD3_DATA2, SD3_DATA3, SD3_DATA4, SD3_DATA5, SD3_DATA6, SD3_DATA7

### Nets
GND: C57.1 C58.1 C59.1 C60.2 C61.1 C62.1 C63.1 C64.1 C65.1 C66.2 C132#1.1 C133#1.1 C134#1.1 C135#1.2 C136#1.2 J3#1.10(GND) J3#1.11(GND) J3#1.12(GND) J3#1.13(GND) R36.2 T2.1 U2.A6(VSS1) U2.C4(VSSQ1) U2.E7(VSS2) U2.G5(VSS3) U2.H10(VSS4) U2.J5(VSS5) U2.K8(VSS6) U2.N2(VSSQ2) U2.N5(VSSQ3) U2.P4(VSSQ4) U2.P6(VSSQ5) U11#1.4(VSS) U11#1.9(VSS)
NVCC_SD2: R30.1 R35.1 R40.2
VDD_1V8: C60.1 C61.2 C62.2 C63.2 C64.2 C135#1.1 C136#1.1 R1#1.2 R2#1.2 R29.2 R34.2 U2.C6(VCCQ1) U2.M4(VCCQ2) U2.N4(VCCQ3) U2.P3(VCCQ4) U2.P5(VCCQ5) U11#1.8(VCC)
VDD_3V3: C57.2 C58.2 C59.2 U2.E6(VCC1) U2.F5(VCC2) U2.J10(VCC3) U2.K9(VCC4)
VSD_3V3: C133#1.2 C134#1.2 J3#1.4(VDD) PTP38#1.1(TP) T2.2
eMMC_VDDIM: C65.2 C66.1 PTP1#1.1(TP) U2.C2(VDDI)
QSPIA_DATA0: U1.R25(NAND_DATA00) U11#1.5(DQ0) ; off-sheet QSPIA_DATA0, port iMX8_NAND.QSPIA_DATA0
QSPIA_DATA1: U1.L25(NAND_DATA01) U11#1.2(DQ1) ; off-sheet QSPIA_DATA1, port iMX8_NAND.QSPIA_DATA1
QSPIA_DATA2: U1.L24(NAND_DATA02) U11#1.3(W#/DQ2) ; off-sheet QSPIA_DATA2, port iMX8_NAND.QSPIA_DATA2
QSPIA_DATA3: U1.N24(NAND_DATA03) U11#1.7(DQ3/HOLD#) ; off-sheet QSPIA_DATA3, port iMX8_NAND.QSPIA_DATA3
QSPIA_DQS: C132#1.2 R29.1 U1.R26(NAND_DQS)
QSPIA_nSS0: R34.1 U1.L26(NAND_CE0_B) U11#1.1(S#) ; off-sheet QSPIA_nSS0, port iMX8_NAND.QSPIA_nSS0
QSPIA_SCLK: U1.N25(NAND_ALE) U11#1.6(C) ; off-sheet QSPIA_SCLK, port iMX8_NAND.QSPIA_SCLK
SD1_CLK: U1.W28(SD1_CLK) ; off-sheet SD1_CLK, port iMX8_SD1.SD1_CLK
SD1_CMD: U1.W29(SD1_CMD) ; off-sheet SD1_CMD, port iMX8_SD1.SD1_CMD
SD1_DATA0: U1.Y29(SD1_DATA0) ; off-sheet SD1_DATA0, port iMX8_SD1.SD1_DATA0
SD1_DATA1: U1.Y28(SD1_DATA1) ; off-sheet SD1_DATA1, port iMX8_SD1.SD1_DATA1
SD1_DATA2: U1.V29(SD1_DATA2) ; off-sheet SD1_DATA2, port iMX8_SD1.SD1_DATA2
SD1_DATA3: U1.V28(SD1_DATA3) ; off-sheet SD1_DATA3, port iMX8_SD1.SD1_DATA3
SD1_DATA4: U1.U26(SD1_DATA4) ; off-sheet SD1_DATA4, port iMX8_SD1.SD1_DATA4
SD1_DATA5: U1.AA29(SD1_DATA5) ; off-sheet SD1_DATA5, port iMX8_SD1.SD1_DATA5
SD1_DATA6: U1.AA28(SD1_DATA6) ; off-sheet SD1_DATA6, port iMX8_SD1.SD1_DATA6
SD1_DATA7: U1.U25(SD1_DATA7) ; off-sheet SD1_DATA7, port iMX8_SD1.SD1_DATA7
SD1_RESET_B: U1.W25(SD1_RESET_B) ; off-sheet SD1_RESET_B, port iMX8_SD1.SD1_RESET_B
SD1_STROBE: U1.W26(SD1_STROBE) ; off-sheet SD1_STROBE, port iMX8_SD1.SD1_STROBE
SD2_CLK: R37.2 U1.AB29(SD2_CLK) ; off-sheet SD2_CLK, port iMX8_SD2.SD2_CLK
SD2_CMD: R30.2 R33.2 U1.AB28(SD2_CMD) ; off-sheet SD2_CMD, port iMX8_SD2.SD2_CMD
SD2_DATA0: R35.2 R38.2 U1.AC28(SD2_DATA0) ; off-sheet SD2_DATA0, port iMX8_SD2.SD2_DATA0
SD2_DATA1: R39.2 U1.AC29(SD2_DATA1) ; off-sheet SD2_DATA1, port iMX8_SD2.SD2_DATA1
SD2_DATA2: R31.1 U1.AA26(SD2_DATA2) ; off-sheet SD2_DATA2, port iMX8_SD2.SD2_DATA2
SD2_DATA3: R32.2 U1.AA25(SD2_DATA3) ; off-sheet SD2_DATA3, port iMX8_SD2.SD2_DATA3
SD2_nCD: J3#1.9(CDSW1) PTP39#1.1(TP) U1.AD29(SD2_CD_B) ; off-sheet SD2_nCD, port iMX8_SD2.SD2_nCD
SD2_RESET_B: PTP40#1.1(TP) R40.1 U1.AD28(SD2_RESET_B) ; off-sheet SD2_RESET_B
SD2_WP: U1.AC26(SD2_WP) ; off-sheet SD2_WP, port iMX8_SD2.SD2_WP
SD3_CLK: U1.U28(NAND_WE_B) U2.M6(CLK) ; off-sheet SD3_CLK, port iMX8_NAND.SD3_CLK
SD3_CMD: R2#1.1 U1.U29(NAND_WP_B) U2.M5(CMD) ; off-sheet SD3_CMD, port iMX8_NAND.SD3_CMD
SD3_DATA0: R1#1.1 U1.P29(NAND_DATA04) U2.A3(DAT0) ; off-sheet SD3_DATA0, port iMX8_NAND.SD3_DATA0
SD3_DATA1: U1.N29(NAND_DATA05) U2.A4(DAT1) ; off-sheet SD3_DATA1, port iMX8_NAND.SD3_DATA1
SD3_DATA2: U1.M29(NAND_DATA06) U2.A5(DAT2) ; off-sheet SD3_DATA2, port iMX8_NAND.SD3_DATA2
SD3_DATA3: U1.R29(NAND_DATA07) U2.B2(DAT3) ; off-sheet SD3_DATA3, port iMX8_NAND.SD3_DATA3
SD3_DATA4: U1.R28(NAND_RE_B) U2.B3(DAT4) ; off-sheet SD3_DATA4, port iMX8_NAND.SD3_DATA4
SD3_DATA5: U1.P28(NAND_CE2_B) U2.B4(DAT5) ; off-sheet SD3_DATA5, port iMX8_NAND.SD3_DATA5
SD3_DATA6: U1.N28(NAND_CE3_B) U2.B5(DAT6) ; off-sheet SD3_DATA6, port iMX8_NAND.SD3_DATA6
SD3_DATA7: U1.M28(NAND_CLE) U2.B6(DAT7) ; off-sheet SD3_DATA7, port iMX8_NAND.SD3_DATA7
SD3_STROBE: PTP2#1.1(TP) U1.T29(NAND_CE1_B) U2.H5(RCLK) ; off-sheet SD3_STROBE, port iMX8_NAND.SD3_STROBE
SYS_STATUS: U1.T28(NAND_READY_B)
NetJ3#1_1: J3#1.1(DAT2) R31.2
NetJ3#1_2: J3#1.2(CD/DAT3) R32.1
NetJ3#1_3: J3#1.3(CMD) R33.1
NetJ3#1_5: J3#1.5(CLK) R37.1
NetJ3#1_6: J3#1.6(VSS) R36.1
NetJ3#1_7: J3#1.7(DAT0) R38.1
NetJ3#1_8: J3#1.8(DAT1) R39.1

Not connected (* = marked no-connect by the designer): U2 A1(NC_A1)* A2(NC_A2)* A7(NC_A7)* A8(NC_A8)* A9(NC_A9)* A10(NC_A10)* A11(NC_A11)* A12(NC_A12)* A13(NC_A13)* A14(NC_A14)* B1(NC_B1)* B7(NC_B7)* B8(NC_B8)* B9(NC_B9)* B10(NC_B10)* B11(NC_B11)* B12(NC_B12)* B13(NC_B13)* B14(NC_B14)* C1(NC_C1)* C3(NC_C3)* C5(NC_C5)* C7(NC_C7)* C8(NC_C8)* C9(NC_C9)* C10(NC_C10)* C11(NC_C11)* C12(NC_C12)* C13(NC_C13)* C14(NC_C14)* D1(NC_D1)* D2(NC_D2)* D3(NC_D3)* D4(NC_D4)* D12(NC_D12)* D13(NC_D13)* D14(NC_D14)* E1(NC_E1)* E2(NC_E2)* E3(NC_E3)* E5(NC_E5)* E8(NC_E8)* E9(VSF1)* E10(VSF2)* E12(NC_E12)* E13(NC_E13)* E14(NC_E14)* F1(NC_F1)* F2(NC_F2)* F3(NC_F3)* F10(VSF3)* F12(NC_F12)* F13(NC_F13)* F14(NC_F14)* G1(NC_G1)* G2(NC_G2)* G3(NC_G3)* G10(NC_G10)* G12(NC_G12)* G13(NC_G13)* G14(NC_G14)* H1(NC_H1)* H2(NC_H2)* H3(NC_H3)* H12(NC_H12)* H13(NC_H13)* H14(NC_H14)* J1(NC_J1)* J2(NC_J2)* J3(NC_J3)* J12(NC_J12)* J13(NC_J13)* J14(NC_J14)* K1(NC_K1)* K2(NC_K2)* K3(NC_K3)* K5(~{RST})* K6(NC_K6)* K7(NC_K7)* K10(VSF4)* K12(NC_K12)* K13(NC_K13)* K14(NC_K14)* L1(NC_L1)* L2(NC_L2)* L3(NC_L3)* L12(NC_L12)* L13(NC_L13)* L14(NC_L14)* M1(NC_M1)* M2(NC_M2)* M3(NC_M3)* M7(NC_M7)* M8(NC_M8)* M9(NC_M9)* M10(NC_M10)* M11(NC_M11)* M12(NC_M12)* M13(NC_M13)* M14(NC_M14)* N1(NC_N1)* N3(NC_N3)* N6(NC_N6)* N7(NC_N7)* N8(NC_N8)* N9(NC_N9)* N10(NC_N10)* N11(NC_N11)* N12(NC_N12)* N13(NC_N13)* N14(NC_N14)* P1(NC_P1)* P2(NC_P2)* P7(NC_P7)* P8(NC_P8)* P9(NC_P9)* P10(NC_P10)* P11(NC_P11)* P12(NC_P12)* P13(NC_P13)* P14(NC_P14)*

### Layout directives
net class SEC: SD3_CLK, SD3_CMD, SD3_DATA0, SD3_DATA1, SD3_DATA2, SD3_DATA3, SD3_DATA4, SD3_DATA5, SD3_DATA6, SD3_DATA7
net class SDIO: SD1_CLK, SD1_CMD, SD1_DATA0, SD1_DATA1, SD1_DATA2, SD1_DATA3, SD1_DATA4, SD1_DATA5, SD1_DATA6, SD1_DATA7, SD1_STROBE, SD2_CLK, SD2_CMD, SD2_DATA0, SD2_DATA1, SD2_DATA2, SD2_DATA3

### Notes on the sheet
- For QSPI High Speed Operation, use dummy DQS generated by FlexSPI controller and looped back through the DQS pad.
  Use 10-18pF cap load on DQS to compensate SIO/SCK pins load.
- QSPI Flash
- (near U11#1) 32MB
- DWG NO:
- REV:
- THIS DOCUMENT AND THE DATA DISCLOSED HEREIN OR
- HEREWITH IS THE PROPERTY OF ALTIUM LIMITED AND MAY
- BE FREELY DISTRIBUTED IN WHOLE. NO RIGHTS ARE
- RESERVED OR EXPRESS OR IMPLIED WARANTEE GIVEN.
- REVISION
- DESCRIPTION
- DATE
- APPROVED
- ENG:
- APPROVALS
- PROJECT
- DSN:
- CHK:
- REFERENCE DOCUMENTS
- PROJECT REVISION:
- TITLE
- DOCUMENT REVISION:
- DESIGN ITEM:
- BOM:
- FAB DWG:
- PCB DWG:
- ASSY DWG:
- SCALE:
- A2
- SIZE
- CAGE CODE
- FILE NAME
- DWG NO.
- SHEET
- OF
- REV
- (in symbol 693071020811) Micro SIM Card
- (in symbol CMP-001-000983-8, part I) i.MX8MP - NAND
- (in symbol CMP-001-000983-8, part J) i.MX8MP - SD
- (in symbol CMP-001-001175-2, part A) eMMC / 512GB

### Library data of the parts
C57 = CMP-001-000888-12: CAP; Part Number: GRT155C81A475ME13J; Manufacturer: Murata; Sort order: 304; HasBeenBuilt: TBD; Alternative component: Allowed; System: RLC; Voltage: 10V; Temperature characteristics: X6S; Tolerance: +/-10%; ComponentLink2Description: 2_Product page; Package: 0402; Creation date: 26042024; ComponentLink1Description: 1_Datasheet; ComponentLink3Description: 3_X-information; ComponentLink4Description: 4_X-information; Manufacturer Part Number: GRT155C81A475ME13J; Component Type: Capacitor
C58 C59 C61-C65 C136#1 = CMP-001-000889-11: CAP; Part Number: GRM033C81A224KE01D; Manufacturer: Murata; Temperature characteristics: X6S; Voltage: 10V; Tolerance: +/-20%; Sort order: 302; HasBeenBuilt: TBD; Alternative component: Allowed; System: RLC; Package: 0201; Dimensions WxLxH: 0.35; ComponentLink1Description: 1_Datasheet; ComponentLink2Description: 2_Product page; ComponentLink3Description: 3_X-information; ComponentLink4Description: 4_X-information; Creation date: 26042024; ClassName: SMALL; Manufacturer Part Number: GRM033C81A224KE01D; Component Type: Capacitor
C60 C66 C135#1 = CMP-001-000883-14: CAP; Part Number: GMC04X6S106M6R3NT; Manufacturer: Cal-Chip Electronics, Inc.; Manufacturer: Cal-Chip Electronics; Voltage: 6.3V; Tolerance: +/-20%; Temperature characteristics: X6S; Sort order: 304; HasBeenBuilt: TBD; Alternative component: Allowed; System: RLC; Package: 0402; ComponentLink1Description: 1_Datasheet; ComponentLink2Description: 2_Product page; ComponentLink3Description: 3_X-information; ComponentLink4Description: 4_X-information; Creation date: 26042024; Manufacturer Part Number: GMC04X6S106M6R3NT; Component Type: Capacitor
C132#1 = CMP-001-000400-12: CAP_RF_MATCHING; Part Number: GJM0335C1E180JB01; Manufacturer: Murata; Voltage: 25V; Tolerance: +/-2%; Temperature characteristics: C0G; Remark: RF matching, use part number; Sort order: 202; HasBeenBuilt: TBD; System: RLC; Package: 0201; ClassName: SMALL; ComponentLink1Description: 1_Datasheet; ComponentLink2Description: 2_Product page; ComponentLink3Description: 3_X-information; ComponentLink4Description: 4_X-information; Creation date: 20200101; Source: RLC_UN1Q.SchLib; Manufacturer Part Number: GJM0335C1E180JB01; Component Type: Capacitor
C133#1 = CMP-001-000385-16: as C89 on sheet IMX8_DISPLAY; Package: 0201; ClassName: SMALL; ComponentLink1Description: 1_Datasheet; ComponentLink2Description: 2_Product page; ComponentLink3Description: 3_X-information; ComponentLink4Description: 4_X-information; Creation date: 20190101; Source: RLC_UN1Q.SchLib; Manufacturer Part Number: GRM033C71C104KE14D; Component Type: Capacitor
C134#1 = CMP-001-001071-3: CAP; Part Number: GRM32EC81C476KE15K; Manufacturer: Murata; Temperature characteristics: X6S; Tolerance: ±10%; Sort order: 304; HasBeenBuilt: no; Alternative component: Allowed; System: RLC; Package: 1210; Operating temperature range: -55 ... +105 °C; Dimensions WxLxH: 2.5 x 3.2 x 2.5; ComponentLink1Description: 2_Product_page; ComponentLink2Description: 2_Product page; ComponentLink3Description: 3_X-information; ComponentLink4Description: 4_X-information; Creation date: 20250214; ECCN: EAR99; RoHS: RoHS3; Manufacturer Part Number: GRM32EC81C476KE15K; Component Type: Capacitor
J3#1 = 693071020811: MF: {'manufacturer': u'W\xfcrth Elektronik'}; Package: None; Price: None; Value: *; MP: 693071020811; Availability: Unavailable
PTP1#1 PTP2#1 PTP38#1 PTP39#1 PTP40#1 = CMP-001-001296-3: as PTP14-PTP19 on sheet IMX8_DISPLAY; ComponentLink4Description: 4_X-information; ComponentLink1Description: 1_Datasheet; Sort order: -; ClassName: SMALL; System: Test Point; HasBeenBuilt: -; Design Item ID: PTP_0.4mm; ComponentLink3Description: 3_X-information; Creation date: 20240909; ComponentLink2Description: 2_Product page; Component Type: Test Point
R1#1 R2#1 R29 R30 R35 = CMP-001-000434-10: Not Assembled - RES; Sort order: 999; HasBeenBuilt: TBD; System: RLC; Package: 0201; ClassName: SMALL; ComponentLink1Description: 1_Datasheet; ComponentLink2Description: 2_Product page; ComponentLink3Description: 3_X-information; ComponentLink4Description: 4_X-information; Creation date: 20190101; Source: RLC_UN1Q.SchLib; Component Type: Resistor
R31-R33 R36-R39 = CMP-001-000429-13: RES; Part Number: RC0201JR-070RL; Manufacturer: YAGEO; Manufacturer: Yageo Group; Tolerance: 5%; Sort order: 322; HasBeenBuilt: TBD; Alternative component: Allowed; System: RLC; Power Rating: 1/20W; Package: 0201; ComponentLink1Description: 1_Datasheet; ComponentLink2Description: 2_Product page; ComponentLink3Description: 3_X-information; ComponentLink4Description: 4_X-information; Creation date: 20190101; ClassName: SMALL; Source: RLC_UN1Q.SchLib; Manufacturer Part Number: RC0201JR-070RL; Component Type: Resistor
R34 = RES_0201_10k: RES; Tolerance: +/-1%; Desc2: resistance_10K_1%_1/20W; Power Rating: 1/20W; Sort order: 322; HasBeenBuilt: TBD; HasBeenChecked: None; System: RLC; Value: 10k; Package: 0201; ClassName: SMALL; ComponentLink1Description: 1_Datasheet; ComponentLink2Description: 2_Product_page; ComponentLink3Description: 3_X-information; ComponentLink4Description: 4_X-information; Creation date: 20190101
R40 = CMP-001-000475-13: RES; Part Number: RC0201FR-074K7L; Manufacturer: YAGEO; Manufacturer: Yageo Group; Power Rating: 1/20W; Sort order: 322; HasBeenBuilt: TBD; Alternative component: Allowed; Tolerance: 1%; System: RLC; Package: 0201; ClassName: SMALL; ComponentLink1Description: 1_Datasheet; ComponentLink2Description: 2_Product page; ComponentLink3Description: 3_X-information; ComponentLink4Description: 4_X-information; Creation date: 20190101; Source: RLC_UN1Q.SchLib; Manufacturer Part Number: RC0201FR-074K7L; Component Type: Resistor
T2 = CMP-001-001100-2: ESD Protection  TVS Diodes SMP Diode 0201 5vdc 2.5pf <12v clamp@1a; Part Number: GG0201052R542P; Manufacturer: KYOCERA AVX; Voltage: 5.0V; Sort order: 402; System: Discrete; Package: 0201; Operating temperature range: -55 ... +125C; ComponentLink1Description: 1_Datasheet; ComponentLink1URL: https://datasheets.kyocera-avx.com/AVX-GiGuard.pdf; ComponentLink2Description: 2_Product page; ComponentLink3Description: 3_X-information; ComponentLink4Description: 4_X-information; Creation date: 20250310; ClassName: SMALL; Manufacturer Part Number: GG0201052R542P; Component Type: ESD & EMI
U1 = CMP-001-000983-8: as U1 on sheet IMX8_DISPLAY; ComponentLink1Description: 1_Datasheet; ComponentLink1URL: https://www.nxp.com/part/MIMX8ML8CVNKZAB#/; ComponentLink2Description: 2_Product page; ComponentLink3Description: 3_X-information; ComponentLink4Description: 4_X-information; Creation date: 20240524; Dimensions WxLxH: 15 x 15 x 1.33mm; Manufacturer: NXP SEMICONDUCTORS; Operating temperature range: -40... +105 °C; Package: FCBGA548; Part Number: MIMX8ML8CVNKZAB; ClassName: BIG; Source: UUDET_KOMPONENTIT.SchLib; Design Item ID: MIMX8ML8CVNKZAB; Manufacturer Part Number: MIMX8ML8CVNKZAB; Component Type: Processor
U2 = CMP-001-001175-2: MEM NAND FLASH 512GB eMMC 5.1 HS400 2.7-3.6V, 1.8V VCCQ, TFBGA153 Ferri-eMMC Automotive; Manufacturer: Silicon Motion, Inc.; Manufacturer Part Number: SM662PBFBFSS; Sort order: 511; System: IC; ComponentLink1Description: 1_Datasheet; ComponentLink2Description: 2_Product page; ComponentLink2URL: https://www.siliconmotion.com/products/Ferri-eMMC/detail; ComponentLink3Description: 3_Product brief; ComponentLink3URL: https://www.siliconmotion.com/download/DWo5/a/Ferri-eMMC_PB_EN.pdf; ComponentLink4Description: 4_X-information; Creation Date: 20250508; Dimensions WxLxH: 11.5 x 13 x 1.2 mm; Operating temperature range: -40 .... +105 °C; Package: TFBGA-153; Part Number: SM662PBF BFS; Component Type: Memory
U11#1 = MT25QU256ABA1EW7-0SIT: Description; Manufacturer_Name: Micron; Copyright: Copyright (C) 2025 Ultra Librarian. All rights reserved.; Manufacturer_Part_Number: MT25QU256ABA1EW7-0SIT; RefDes: RefDes; Type: Type

## Sheet IMX8_IO.SchDoc
size 594 x 420 mm; SheetNumber: 6; SheetTotal: 20
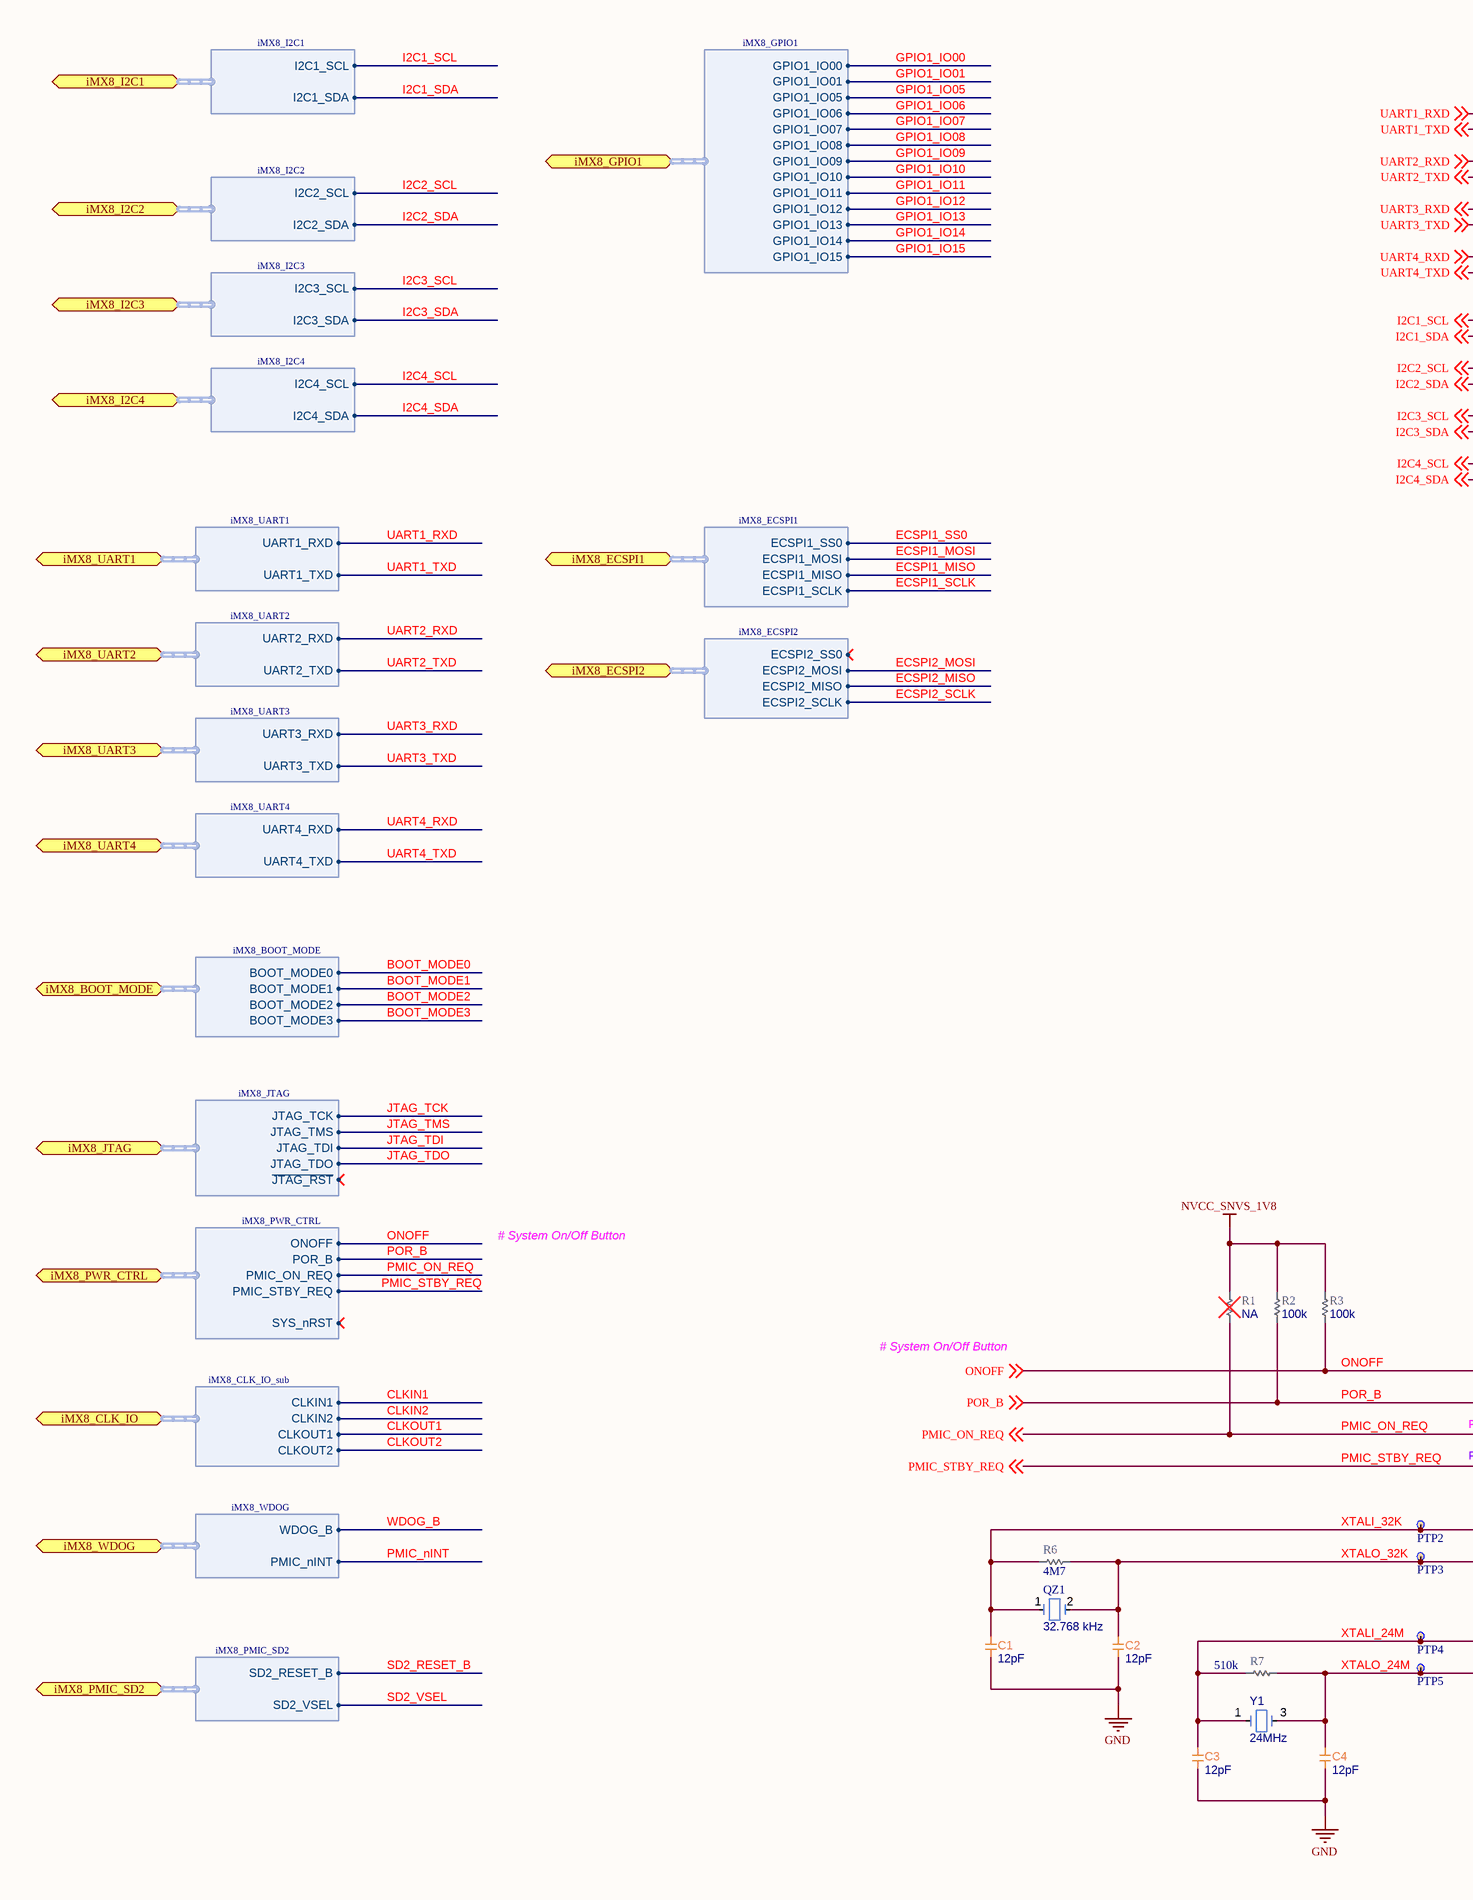
[diagram p12: IMX8_IO.SchDoc, left]
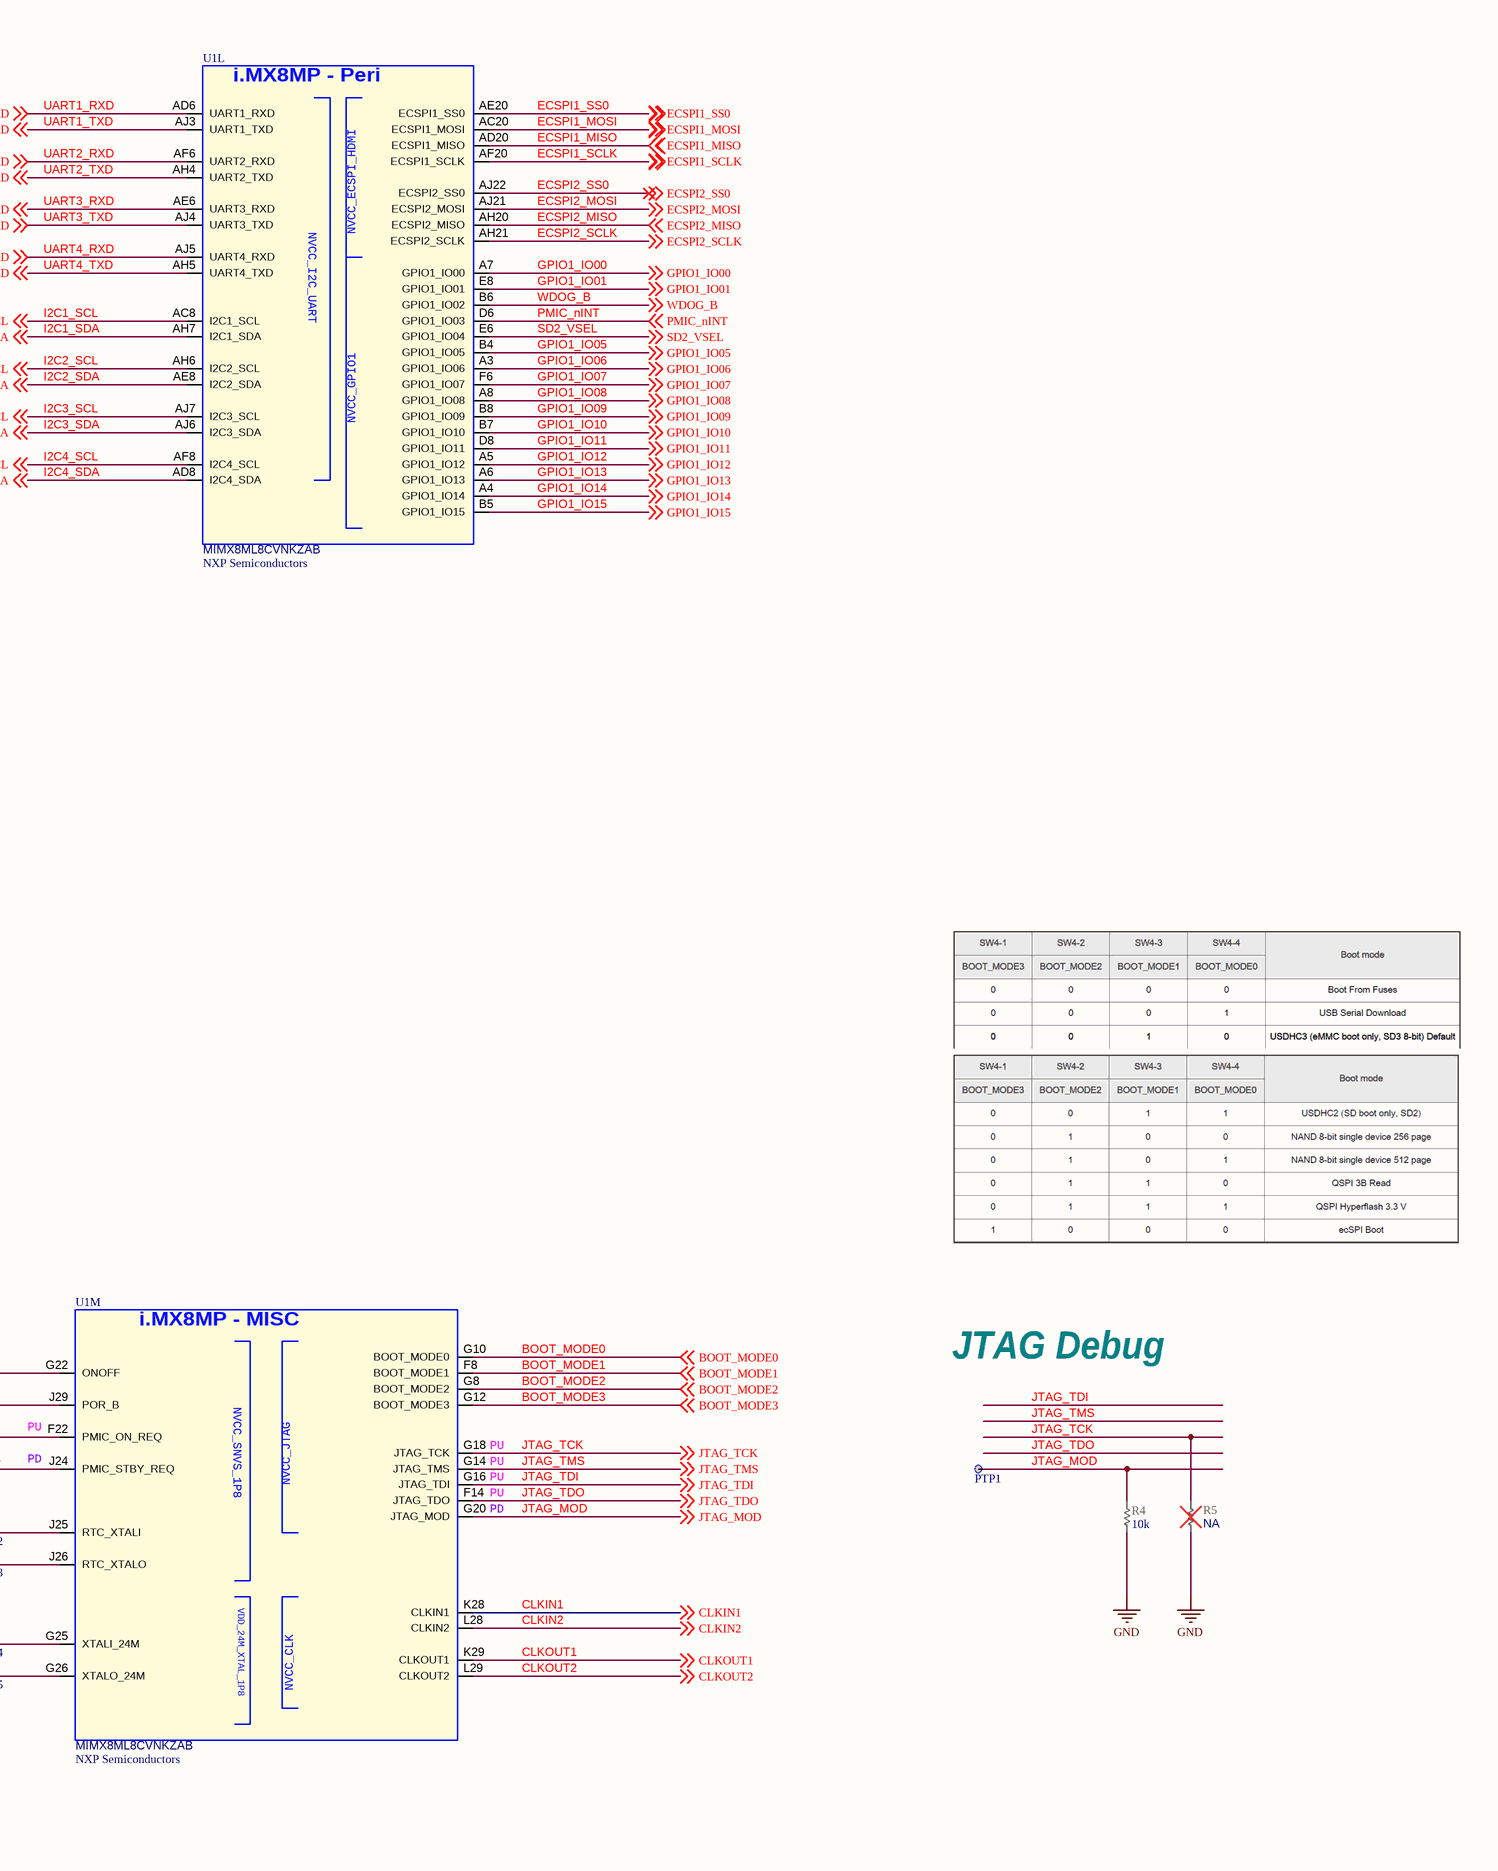
[diagram p13: IMX8_IO.SchDoc, right]

### Parts
(Parts that share a designator on the sheet are numbered #1, #2 ... from top to bottom, then left to right.)
C1#1  value 12pF  [CAP_0201_UN1Q]  (hidden comment: CAP_0201_12pF_RF_MATCHING)
C2#1  value 12pF  [CAP_0201_UN1Q]  (hidden comment: CAP_0201_12pF_RF_MATCHING)
C3#1  value 12pF  [CAP_0201_UN1Q]  (hidden comment: CAP_0201_12pF_RF_MATCHING)
C4#1  value 12pF  [CAP_0201_UN1Q]  (hidden comment: CAP_0201_12pF_RF_MATCHING)
PTP1#2  PTP_0.4mm  [PTP_0.4mm]  (value not drawn)  (no BOM)
PTP2#2  PTP_0.4mm  [PTP_0.4mm]  (value not drawn)  (no BOM)
PTP3  PTP_0.4mm  [PTP_0.4mm]  (value not drawn)  (no BOM)
PTP4  PTP_0.4mm  [PTP_0.4mm]  (value not drawn)  (no BOM)
PTP5  PTP_0.4mm  [PTP_0.4mm]  (value not drawn)  (no BOM)
QZ1  value 32.768 kHz  [CM8V32768TA020125_MC]  (hidden comment: XTAL_CM8V-T1A-32_768KHZ-9PF-20PPM-TA-QC)
R1#2  value NA  [RES_0201_UN1Q]  (hidden comment: RES_0201_NA)
R2#2  value 100k  [RES_0201_UN1Q]  (hidden comment: RES_0201_100k)
R3  value 100k  [RES_0201_UN1Q]  (hidden comment: RES_0201_100k)
R4  value 10k  [RES_0201_UN1Q]  (hidden comment: RES_0201_10k)
R5  value NA  [RES_0201_UN1Q]  (hidden comment: RES_0201_NA)
R6  value 4M7  [RES_0201_UN1Q]  (hidden comment: RES_0201_4M7)
R7  value 510k  [RES_0201_UN1Q]  (hidden comment: RES_0201_510k)
U1  Manufacturer: NXP Semiconductors  [BGA548C50P29X29_1500X1500X148]  (hidden comment: MIMX8ML8CVNKZAB)  (parts L,M of 15)
Y1  value 24MHz  [XTAL_3225_EPSON]  (hidden comment: XTAL_24M_10ppm_9pF_+105C)

### Ports
iMX8_BOOT_MODE (bidir, harness iMX8_BOOT_MODE), iMX8_CLK_IO (bidir, harness iMX8_CLK_IO_sub), iMX8_ECSPI1 (bidir, harness iMX8_ECSPI1), iMX8_ECSPI2 (bidir, harness iMX8_ECSPI2), iMX8_GPIO1 (bidir, harness iMX8_GPIO1), iMX8_I2C1 (bidir, harness iMX8_I2C1), iMX8_I2C2 (bidir, harness iMX8_I2C2), iMX8_I2C3 (bidir, harness iMX8_I2C3), iMX8_I2C4 (bidir, harness iMX8_I2C4), iMX8_JTAG (bidir, harness iMX8_JTAG), iMX8_PMIC_SD2 (bidir, harness iMX8_PMIC_SD2), iMX8_PWR_CTRL (bidir, harness iMX8_PWR_CTRL), iMX8_UART1 (bidir, harness iMX8_UART1), iMX8_UART2 (bidir, harness iMX8_UART2), iMX8_UART3 (bidir, harness iMX8_UART3), iMX8_UART4 (bidir, harness iMX8_UART4), iMX8_WDOG (bidir, harness iMX8_WDOG)

### Harnesses
iMX8_JTAG: JTAG_TCK, JTAG_TMS, JTAG_TDI, JTAG_TDO, ~{JTAG_RST}
iMX8_CLK_IO_sub: CLKIN1, CLKIN2, CLKOUT1, CLKOUT2
iMX8_PWR_CTRL: ONOFF, POR_B, PMIC_ON_REQ, PMIC_STBY_REQ, SYS_nRST
iMX8_I2C1: I2C1_SCL, I2C1_SDA
iMX8_I2C2: I2C2_SCL, I2C2_SDA
iMX8_I2C3: I2C3_SCL, I2C3_SDA
iMX8_I2C4: I2C4_SCL, I2C4_SDA
iMX8_UART1: UART1_RXD, UART1_TXD
iMX8_UART2: UART2_RXD, UART2_TXD
iMX8_UART3: UART3_RXD, UART3_TXD
iMX8_UART4: UART4_RXD, UART4_TXD
iMX8_GPIO1: GPIO1_IO00, GPIO1_IO01, GPIO1_IO05, GPIO1_IO06, GPIO1_IO07, GPIO1_IO08, GPIO1_IO09, GPIO1_IO10, GPIO1_IO11, GPIO1_IO12, GPIO1_IO13, GPIO1_IO14, GPIO1_IO15
iMX8_ECSPI1: ECSPI1_SS0, ECSPI1_MOSI, ECSPI1_MISO, ECSPI1_SCLK
iMX8_WDOG: WDOG_B, PMIC_nINT
iMX8_PMIC_SD2: SD2_RESET_B, SD2_VSEL
iMX8_ECSPI2: ECSPI2_SS0, ECSPI2_MOSI, ECSPI2_MISO, ECSPI2_SCLK
iMX8_BOOT_MODE: BOOT_MODE0, BOOT_MODE1, BOOT_MODE2, BOOT_MODE3

### Nets
GND: C1#1.1 C2#1.2 C3#1.2 C4#1.2 R4.2 R5.2 Y1.2(GND) Y1.4(GND)
NVCC_SNVS_1V8: R1#2.1 R2#2.1 R3.1
BOOT_MODE0: U1.G10(BOOT_MODE0) ; off-sheet BOOT_MODE0, port iMX8_BOOT_MODE.BOOT_MODE0
BOOT_MODE1: U1.F8(BOOT_MODE1) ; off-sheet BOOT_MODE1, port iMX8_BOOT_MODE.BOOT_MODE1
BOOT_MODE2: U1.G8(BOOT_MODE2) ; off-sheet BOOT_MODE2, port iMX8_BOOT_MODE.BOOT_MODE2
BOOT_MODE3: U1.G12(BOOT_MODE3) ; off-sheet BOOT_MODE3, port iMX8_BOOT_MODE.BOOT_MODE3
CLKIN1: U1.K28(CLKIN1) ; off-sheet CLKIN1, port iMX8_CLK_IO.CLKIN1
CLKIN2: U1.L28(CLKIN2) ; off-sheet CLKIN2, port iMX8_CLK_IO.CLKIN2
CLKOUT1: U1.K29(CLKOUT1) ; off-sheet CLKOUT1, port iMX8_CLK_IO.CLKOUT1
CLKOUT2: U1.L29(CLKOUT2) ; off-sheet CLKOUT2, port iMX8_CLK_IO.CLKOUT2
ECSPI1_MISO: U1.AD20(ECSPI1_MISO) ; off-sheet ECSPI1_MISO, port iMX8_ECSPI1.ECSPI1_MISO
ECSPI1_MOSI: U1.AC20(ECSPI1_MOSI) ; off-sheet ECSPI1_MOSI, port iMX8_ECSPI1.ECSPI1_MOSI
ECSPI1_SCLK: U1.AF20(ECSPI1_SCLK) ; off-sheet ECSPI1_SCLK, port iMX8_ECSPI1.ECSPI1_SCLK  [project net ~{mPCIe_RST}]
ECSPI1_SS0: U1.AE20(ECSPI1_SS0) ; off-sheet ECSPI1_SS0, port iMX8_ECSPI1.ECSPI1_SS0  [project net ~{USB_HUB_RST}]
ECSPI2_MISO: U1.AH20(ECSPI2_MISO) ; off-sheet ECSPI2_MISO, port iMX8_ECSPI2.ECSPI2_MISO
ECSPI2_MOSI: U1.AJ21(ECSPI2_MOSI) ; off-sheet ECSPI2_MOSI, port iMX8_ECSPI2.ECSPI2_MOSI
ECSPI2_SCLK: U1.AH21(ECSPI2_SCLK) ; off-sheet ECSPI2_SCLK, port iMX8_ECSPI2.ECSPI2_SCLK
ECSPI2_SS0: U1.AJ22(ECSPI2_SS0) ; off-sheet ECSPI2_SS0
GPIO1_IO00: U1.A7(GPIO1_IO00) ; off-sheet GPIO1_IO00, port iMX8_GPIO1.GPIO1_IO00
GPIO1_IO01: U1.E8(GPIO1_IO01) ; off-sheet GPIO1_IO01, port iMX8_GPIO1.GPIO1_IO01  [project net ~{GPIO_EXP_INT}]
GPIO1_IO05: U1.B4(GPIO1_IO05) ; off-sheet GPIO1_IO05, port iMX8_GPIO1.GPIO1_IO05
GPIO1_IO06: U1.A3(GPIO1_IO06) ; off-sheet GPIO1_IO06, port iMX8_GPIO1.GPIO1_IO06
GPIO1_IO07: U1.F6(GPIO1_IO07) ; off-sheet GPIO1_IO07, port iMX8_GPIO1.GPIO1_IO07
GPIO1_IO08: U1.A8(GPIO1_IO08) ; off-sheet GPIO1_IO08, port iMX8_GPIO1.GPIO1_IO08
GPIO1_IO09: U1.B8(GPIO1_IO09) ; off-sheet GPIO1_IO09, port iMX8_GPIO1.GPIO1_IO09
GPIO1_IO10: U1.B7(GPIO1_IO10) ; off-sheet GPIO1_IO10, port iMX8_GPIO1.GPIO1_IO10
GPIO1_IO11: U1.D8(GPIO1_IO11) ; off-sheet GPIO1_IO11, port iMX8_GPIO1.GPIO1_IO11
GPIO1_IO12: U1.A5(GPIO1_IO12) ; off-sheet GPIO1_IO12, port iMX8_GPIO1.GPIO1_IO12
GPIO1_IO13: U1.A6(GPIO1_IO13) ; off-sheet GPIO1_IO13, port iMX8_GPIO1.GPIO1_IO13
GPIO1_IO14: U1.A4(GPIO1_IO14) ; off-sheet GPIO1_IO14, port iMX8_GPIO1.GPIO1_IO14
GPIO1_IO15: U1.B5(GPIO1_IO15) ; off-sheet GPIO1_IO15, port iMX8_GPIO1.GPIO1_IO15
I2C1_SCL: U1.AC8(I2C1_SCL) ; off-sheet I2C1_SCL, port iMX8_I2C1.I2C1_SCL
I2C1_SDA: U1.AH7(I2C1_SDA) ; off-sheet I2C1_SDA, port iMX8_I2C1.I2C1_SDA
I2C2_SCL: U1.AH6(I2C2_SCL) ; off-sheet I2C2_SCL, port iMX8_I2C2.I2C2_SCL
I2C2_SDA: U1.AE8(I2C2_SDA) ; off-sheet I2C2_SDA, port iMX8_I2C2.I2C2_SDA
I2C3_SCL: U1.AJ7(I2C3_SCL) ; off-sheet I2C3_SCL, port iMX8_I2C3.I2C3_SCL
I2C3_SDA: U1.AJ6(I2C3_SDA) ; off-sheet I2C3_SDA, port iMX8_I2C3.I2C3_SDA
I2C4_SCL: U1.AF8(I2C4_SCL) ; off-sheet I2C4_SCL, port iMX8_I2C4.I2C4_SCL  [project net ~{PCIE_CLK_REQ}]
I2C4_SDA: U1.AD8(I2C4_SDA) ; off-sheet I2C4_SDA, port iMX8_I2C4.I2C4_SDA  [project net ~{PCIE_WAKE}]
JTAG_MOD: PTP1#2.1(TP) R4.1 U1.G20(JTAG_MOD) ; off-sheet JTAG_MOD
JTAG_TCK: R5.1 U1.G18(JTAG_TCK) ; off-sheet JTAG_TCK, port iMX8_JTAG.JTAG_TCK
JTAG_TDI: U1.G16(JTAG_TDI) ; off-sheet JTAG_TDI, port iMX8_JTAG.JTAG_TDI
JTAG_TDO: U1.F14(JTAG_TDO) ; off-sheet JTAG_TDO, port iMX8_JTAG.JTAG_TDO
JTAG_TMS: U1.G14(JTAG_TMS) ; off-sheet JTAG_TMS, port iMX8_JTAG.JTAG_TMS
ONOFF: R3.2 U1.G22(ONOFF) ; off-sheet ONOFF, port iMX8_PWR_CTRL.ONOFF
PMIC_nINT: U1.D6(GPIO1_IO03) ; off-sheet PMIC_nINT, port iMX8_WDOG.PMIC_nINT
PMIC_ON_REQ: R1#2.2 U1.F22(PMIC_ON_REQ) ; off-sheet PMIC_ON_REQ, port iMX8_PWR_CTRL.PMIC_ON_REQ
PMIC_STBY_REQ: U1.J24(PMIC_STBY_REQ) ; off-sheet PMIC_STBY_REQ, port iMX8_PWR_CTRL.PMIC_STBY_REQ
POR_B: R2#2.2 U1.J29(POR_B) ; off-sheet POR_B, port iMX8_PWR_CTRL.POR_B
SD2_VSEL: U1.E6(GPIO1_IO04) ; off-sheet SD2_VSEL, port iMX8_PMIC_SD2.SD2_VSEL
UART1_RXD: U1.AD6(UART1_RXD) ; off-sheet UART1_RXD, port iMX8_UART1.UART1_RXD
UART1_TXD: U1.AJ3(UART1_TXD) ; off-sheet UART1_TXD, port iMX8_UART1.UART1_TXD
UART2_RXD: U1.AF6(UART2_RXD) ; off-sheet UART2_RXD, port iMX8_UART2.UART2_RXD
UART2_TXD: U1.AH4(UART2_TXD) ; off-sheet UART2_TXD, port iMX8_UART2.UART2_TXD
UART3_RXD: U1.AE6(UART3_RXD) ; off-sheet UART3_RXD, port iMX8_UART3.UART3_RXD
UART3_TXD: U1.AJ4(UART3_TXD) ; off-sheet UART3_TXD, port iMX8_UART3.UART3_TXD
UART4_RXD: U1.AJ5(UART4_RXD) ; off-sheet UART4_RXD, port iMX8_UART4.UART4_RXD
UART4_TXD: U1.AH5(UART4_TXD) ; off-sheet UART4_TXD, port iMX8_UART4.UART4_TXD
WDOG_B: U1.B6(GPIO1_IO02) ; off-sheet WDOG_B, port iMX8_WDOG.WDOG_B
XTALI_24M: C3#1.1 PTP4.1(TP) R7.1 U1.G25(XTALI_24M) Y1.1
XTALI_32K: C1#1.2 PTP2#2.1(TP) QZ1.1 R6.1 U1.J25(RTC_XTALI)
XTALO_24M: C4#1.1 PTP5.1(TP) R7.2 U1.G26(XTALO_24M) Y1.3
XTALO_32K: C2#1.1 PTP3.1(TP) QZ1.2 R6.2 U1.J26(RTC_XTALO)

### Notes on the sheet
- # System On/Off Button
- JTAG Debug
- (near U1) PD
- (near U1) PU
- DWG NO:
- REV:
- THIS DOCUMENT AND THE DATA DISCLOSED HEREIN OR
- HEREWITH IS THE PROPERTY OF ALTIUM LIMITED AND MAY
- BE FREELY DISTRIBUTED IN WHOLE. NO RIGHTS ARE
- RESERVED OR EXPRESS OR IMPLIED WARANTEE GIVEN.
- REVISION
- DESCRIPTION
- DATE
- APPROVED
- ENG:
- APPROVALS
- PROJECT
- DSN:
- CHK:
- REFERENCE DOCUMENTS
- PROJECT REVISION:
- TITLE
- DOCUMENT REVISION:
- DESIGN ITEM:
- BOM:
- FAB DWG:
- PCB DWG:
- ASSY DWG:
- SCALE:
- A2
- SIZE
- CAGE CODE
- FILE NAME
- DWG NO.
- SHEET
- OF
- REV
- (in symbol CMP-001-000983-8, part L) i.MX8MP - Peri; NVCC_GPIO1
- (in symbol CMP-001-000983-8, part M) i.MX8MP - MISC

### Library data of the parts
C1#1 C2#1 C3#1 C4#1 = CMP-001-000420-11: CAP_RF_MATCHING; Part Number: GRM0335C1H120GA01; Manufacturer: Murata; Voltage: 50V; Tolerance: +/- 2%; Temperature characteristics: C0G; Remark: RF matching, use part number; Sort order: 202; HasBeenBuilt: TBD; System: RLC; Package: 0201; Operating temperature range: -55 ... +125C; ComponentLink1Description: 1_Datasheet; ComponentLink2Description: 2_Product page; ComponentLink3Description: 3_X-information; ComponentLink4Description: 4_X-information; Creation date: 20211123; ClassName: SMALL; Source: RLC_UN1Q.SchLib; Manufacturer Part Number: GRM0335C1H120GA01; Component Type: Capacitor
PTP1#2 PTP2#2 PTP3-PTP5 = CMP-001-001296-3: as PTP14-PTP19 on sheet IMX8_DISPLAY; ComponentLink4Description: 4_X-information; ComponentLink1Description: 1_Datasheet; Sort order: -; ClassName: SMALL; System: Test Point; HasBeenBuilt: -; Design Item ID: PTP_0.4mm; ComponentLink3Description: 3_X-information; Creation date: 20240909; ComponentLink2Description: 2_Product page; Component Type: Test Point
QZ1 = CMP-001-000697-8: SMT Quartz Crystal; Manufacturer: Micro Crystal; Part Number: CM8V-T1A-32.768KHZ-9PF-20PPM-TA-QC; HasBeenBuilt: SleeveIO_01; Sort order: 455; System: Discrete; ClassName: BIG; ComponentLink1Description: 1_Datasheet; ComponentLink1URL: https://www.microcrystal.com/fileadmin/Media/Products/32kHz/Datasheet/CM8V-T1A.pdf; ComponentLink2Description: 2_Product page; ComponentLink2URL: https://www.microcrystal.com/en/products/khz-quartz-crystals/cm8v-t1a/; ComponentLink3Description: 3_X-information; ComponentLink4Description: 4_X-information; Creation date: 20210913; Dimensions WxLxH: 1.2x2.0x0.6mm; Operating temperature range: -40 .... +85 °C; Package: 2-SMD; Source: Discrete_UN1Q.SchLib; Manufacturer Part Number: CM8V-T1A-32.768KHZ-9PF-20PPM-TA-QC; Component Type: Crystal & Oscillator
R1#2 R5 = CMP-001-000434-10: as R1#1 on sheet IMX8_eMMC; Package: 0201; ClassName: SMALL; ComponentLink1Description: 1_Datasheet; ComponentLink2Description: 2_Product page; ComponentLink3Description: 3_X-information; ComponentLink4Description: 4_X-information; Creation date: 20190101; Source: RLC_UN1Q.SchLib; Component Type: Resistor
R2#2 R3 = CMP-001-000526-11: RES; Part Number: RC0201FR-07100KL; Manufacturer: YAGEO; Tolerance: 1%; Power Rating: 1/20W; Sort order: 322; HasBeenBuilt: TBD; Alternative component: Allowed; System: RLC; Package: 0201; ClassName: SMALL; ComponentLink1Description: 1_Datasheet; ComponentLink2Description: 2_Product page; ComponentLink3Description: 3_X-information; ComponentLink4Description: 4_X-information; Creation date: 20190101; Source: RLC_UN1Q.SchLib; Component Type: Resistor
R4 = CMP-001-000446-13: as R21-R23 on sheet IMX8_DISPLAY; Package: 0201; ClassName: SMALL; ComponentLink1Description: 1_Datasheet; ComponentLink2Description: 2_Product page; ComponentLink3Description: 3_X-information; ComponentLink4Description: 4_X-information; Creation date: 20190101; Source: RLC_UN1Q.SchLib; Component Type: Resistor
R6 = CMP-001-001254-9: RES; Part Number: MCRE000254; Manufacturer: MULTICOMP PRO; Tolerance: 1%; Power Rating: 1/20W; Sort order: 322; Alternative component: Allowed; System: RLC; Package: 0201; ClassName: SMALL; ComponentLink1Description: 1_Datasheet; ComponentLink2Description: 2_Product page; ComponentLink3Description: 3_X-information; ComponentLink4Description: 4_X-information; Creation date: 20240404; Component Type: Resistor
R7 = CMP-001-000576-12: RES; Part Number: ERJ-1GNF5103C; Manufacturer: Panasonic Electronic Components; Sort order: 322; HasBeenBuilt: TBD; Alternative component: Allowed; System: RLC; Power Rating: 1/20W; Tolerance: 1%; Package: 0201; ComponentLink1Description: 1_Datasheet; ComponentLink2Description: 2_Product page; ComponentLink3Description: 3_X-information; ComponentLink4Description: 4_X-information; Creation date: 20211123; Source: RLC_UN1Q.SchLib; ClassName: SMALL; Component Type: Resistor
U1 = CMP-001-000983-8: as U1 on sheet IMX8_DISPLAY; ComponentLink1Description: 1_Datasheet; ComponentLink1URL: https://www.nxp.com/part/MIMX8ML8CVNKZAB#/; ComponentLink2Description: 2_Product page; ComponentLink3Description: 3_X-information; ComponentLink4Description: 4_X-information; Creation date: 20240524; Dimensions WxLxH: 15 x 15 x 1.33mm; Manufacturer: NXP SEMICONDUCTORS; Operating temperature range: -40... +105 °C; Package: FCBGA548; Part Number: MIMX8ML8CVNKZAB; ClassName: BIG; Source: UUDET_KOMPONENTIT.SchLib; Design Item ID: MIMX8ML8CVNKZAB; Manufacturer Part Number: MIMX8ML8CVNKZAB; Component Type: Processor
Y1 = CMP-001-001243-5: Crystal 24 MHz ±10ppm 9pF 40Ohms 4-SMD; Part Number: TSX-3225 24.0000MF20G-AC3; Manufacturer: EPSON; Tolerance: +/-10ppm; Sort order: 455; System: Discrete; Operating temperature range: -40 ... +105C; Dimensions WxLxH: 3.2 x 2.5 x 0.6mm; ComponentLink1Description: 1_Datasheet; ComponentLink1URL: https://support.epson.biz/td/api/doc_check.php?dl=brief_TSX-3225&lang=en; ComponentLink2Description: 2_Product page; ComponentLink3Description: 3_X-information; ComponentLink4Description: 4_X-information; Creation date: 20240430; Manufacturer: Epson; Manufacturer Part Number: TSX-3225 24.0000MF20G-AC3; Component Type: Crystal & Oscillator